# EAGLE schematic cft (EAGLE 5.11), part 1 of 7
DRAWN_BY: Alexios; PROJECT_NAME: CFT Mini-Computer; REVISION: Rev A; SHEET_DESCRIPTION: General Purpose I/O, 2/2; SIMULATION_FILENAME: N/A; URL: http://www.bedroomlan.org/cft

## Sheet 1 of 49
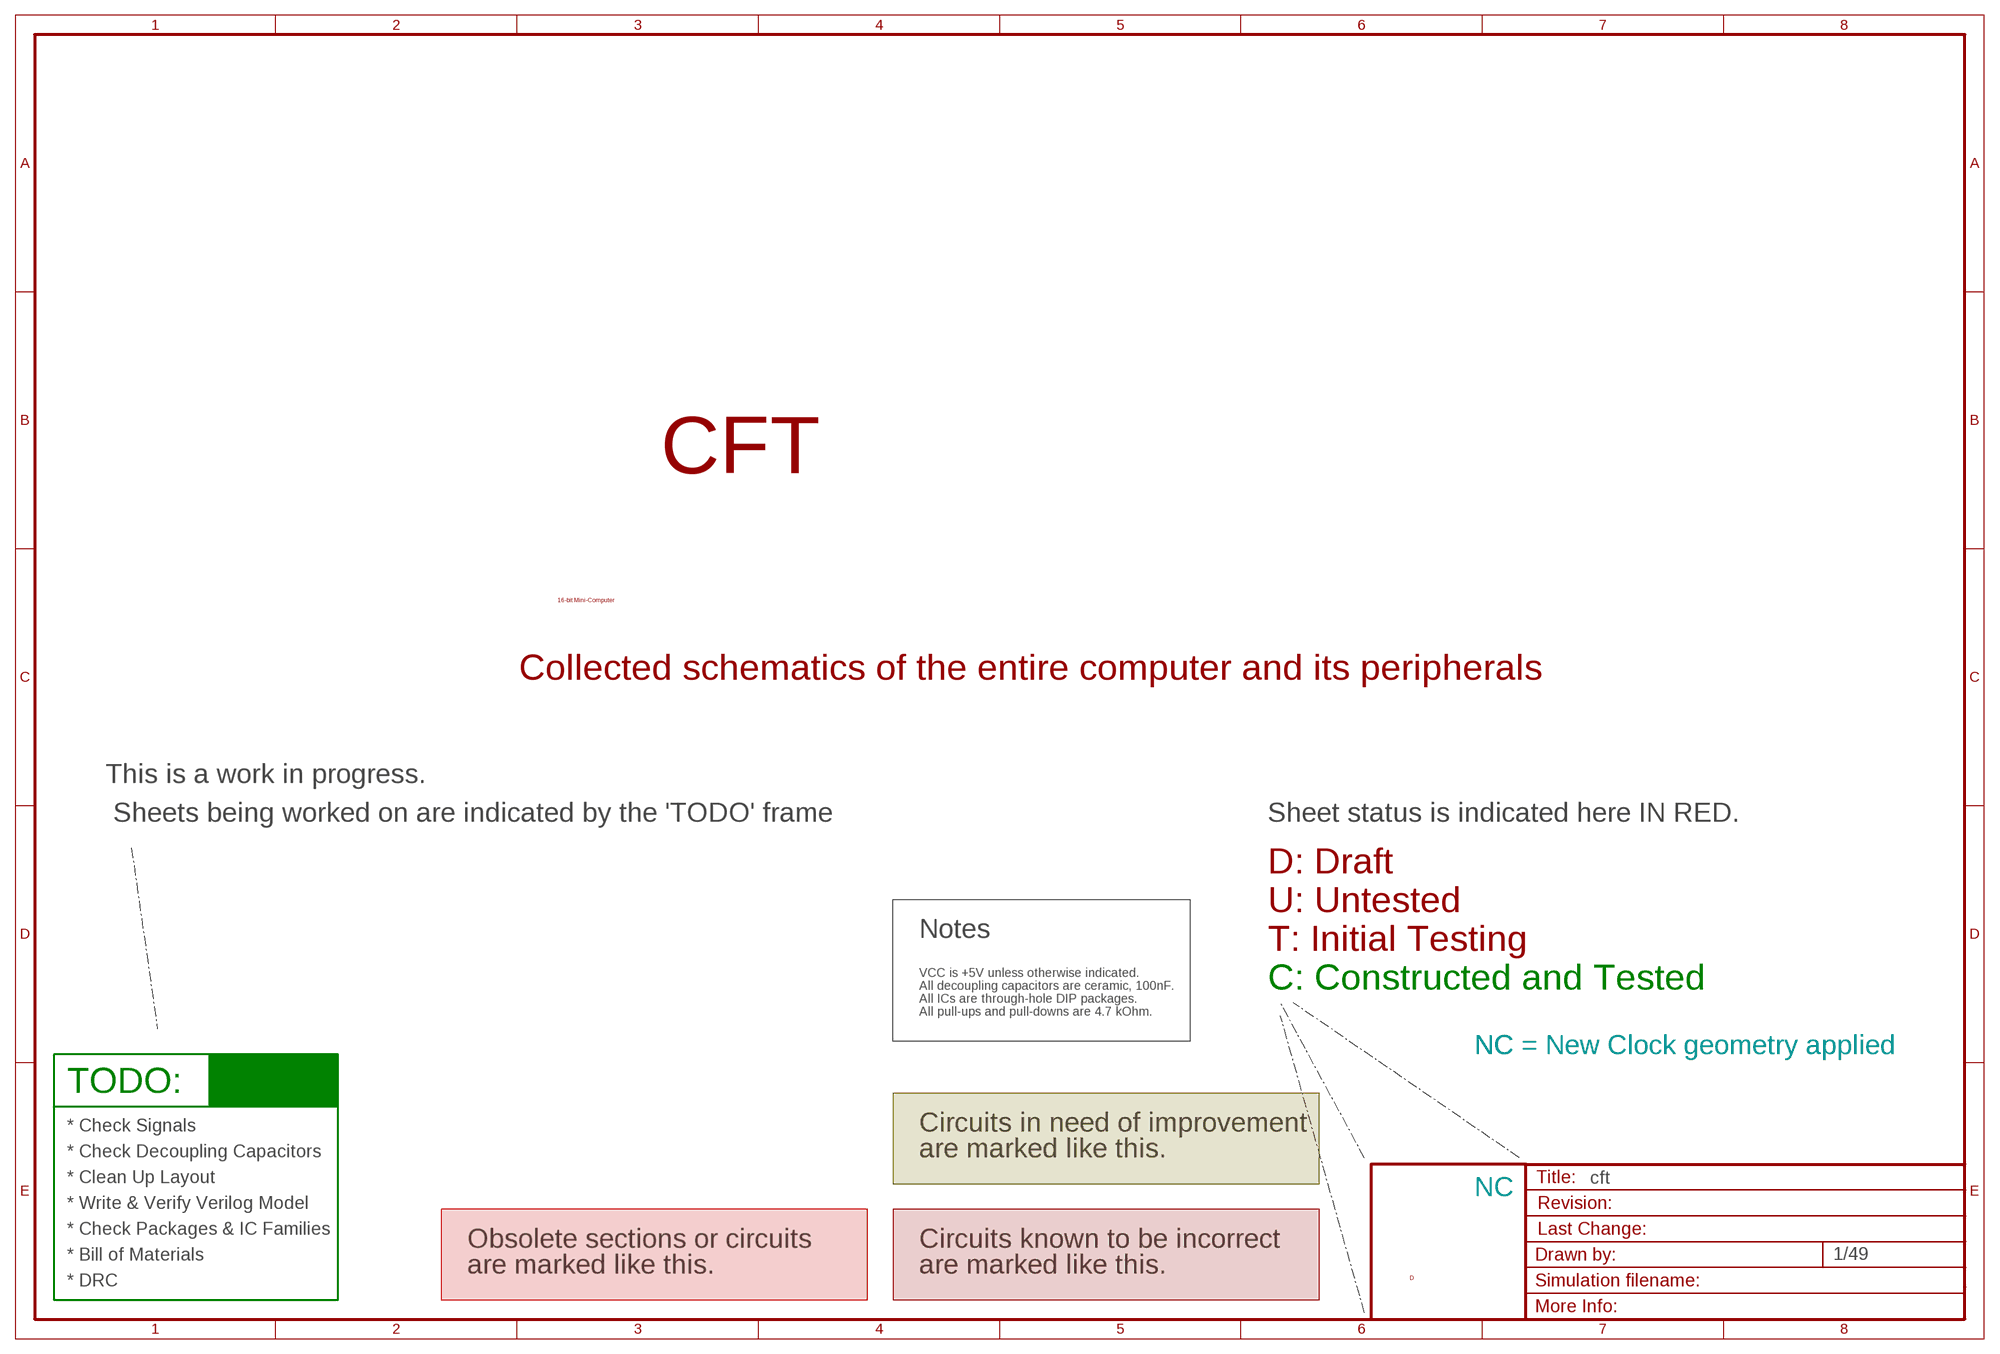
[diagram p0: schematic, sheet 1]

### Notes on the sheet
- CFT
- 16-bit Mini-Computer
- Collected schematics of the entire computer and its peripherals
- This is a work in progress.
- Sheets being worked on are indicated by the 'TODO' frame | Sheet status is indicated here IN RED.
- D: Draft
- U: Untested
- Notes
- T: Initial Testing
- VCC is +5V unless otherwise indicated.
- All decoupling capacitors are ceramic, 100nF. | C: Constructed and Tested
- All ICs are through-hole DIP packages.
- All pull-ups and pull-downs are 4.7 kOhm.
- NC | NC = New Clock geometry applied
- TODO:
- * Check Signals | Circuits in need of improvement
- * Check Decoupling Capacitors | are marked like this.
- * Clean Up Layout
- NC
- * Write & Verify Verilog Model
- * Check Packages & IC Families
- Obsolete sections or circuits | Circuits known to be incorrect
- * Bill of Materials
- are marked like this. | are marked like this.
- D
- * DRC

## Sheet 2 of 49
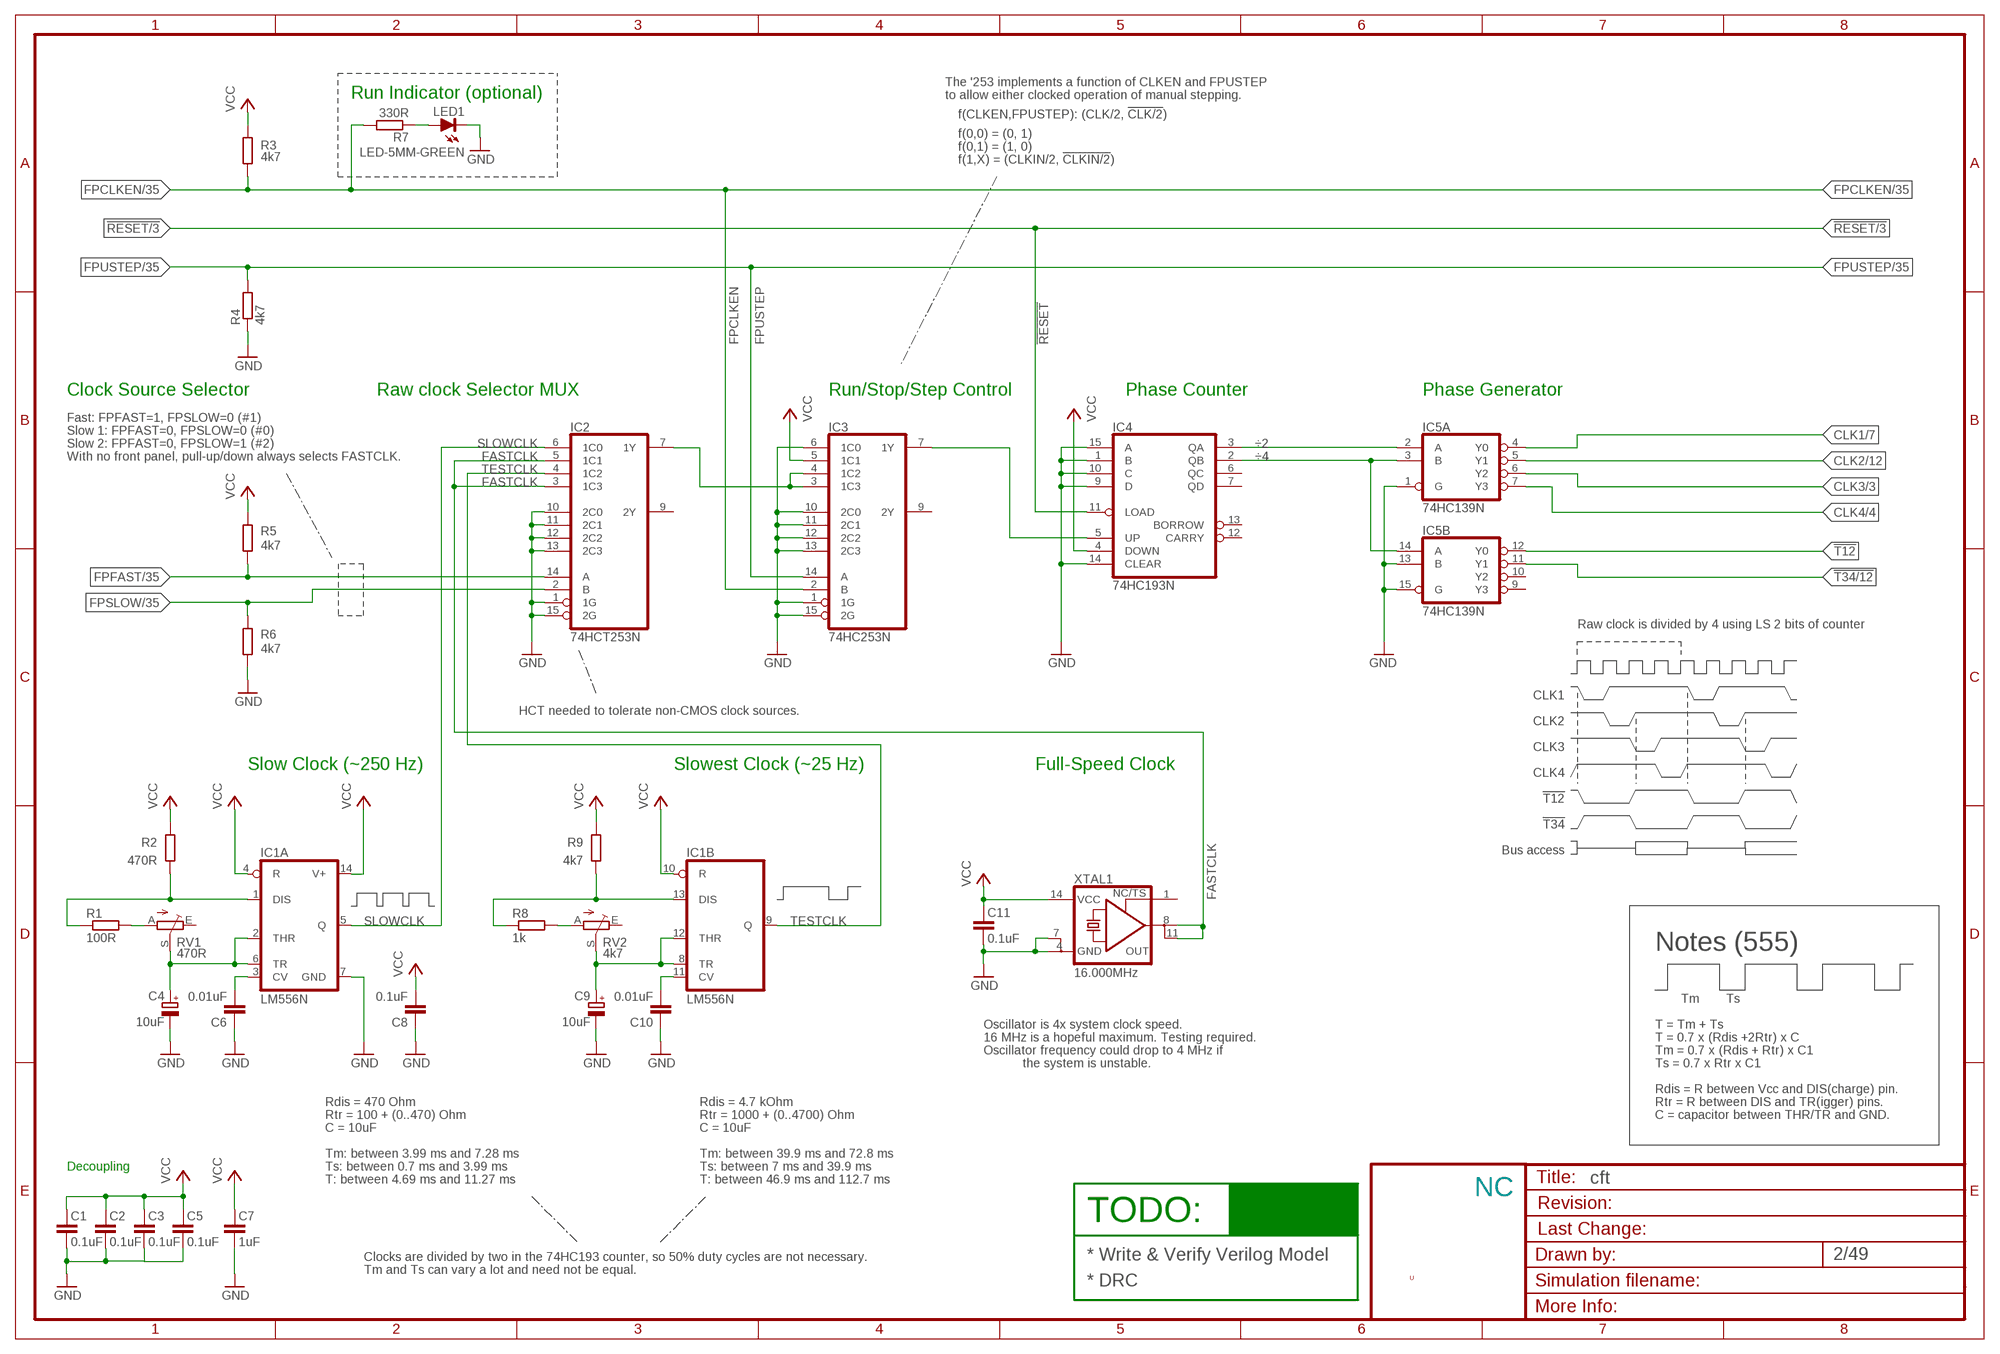
[diagram p1: schematic, sheet 2]

### Parts
C1  0.1uF  C-EU025-024X044  [C025-024X044]
C2  0.1uF  C-EU025-024X044  [C025-024X044]
C3  0.1uF  C-EU025-024X044  [C025-024X044]
C4  10uF  CPOL-EUE2.5-5  [E2,5-5]
C5  0.1uF  C-EU025-024X044  [C025-024X044]
C6  0.01uF  C-EU025-024X044  [C025-024X044]
C7  1uF  C-EU025-024X044  [C025-024X044]
C8  0.1uF  C-EU025-024X044  [C025-024X044]
C9  10uF  CPOL-EUE2.5-5  [E2,5-5]
C10  0.01uF  C-EU025-024X044  [C025-024X044]
C11  0.1uF  C-EU025-024X044  [C025-024X044]
IC1  LM556N  [DIL14]
IC2  74HCT253N  [DIL16]
IC3  74HC253N  [DIL16]
IC4  74HC193N  [DIL16]
IC5  74HC139N  [DIL16]
LED1  LED-5MM-GREEN  [LED5MM]
R1  100R  R-EU_0204/7  [0204/7]
R2  470R  R-EU_0204/7  [0204/7]
R3  4k7  R-EU_0204/7  [0204/7]
R4  4k7  R-EU_0204/7  [0204/7]
R5  4k7  R-EU_0204/7  [0204/7]
R6  4k7  R-EU_0204/7  [0204/7]
R7  330R  R-EU_0204/7  [0204/7]
R8  1k  R-EU_0204/7  [0204/7]
R9  4k7  R-EU_0204/7  [0204/7]
RV1  470R  TRIM_EU-CT6  [CT6]
RV2  4k7  TRIM_EU-CT6  [CT6]
XTAL1  16.000MHz  XO2-08-14-SOCKET  [DIL0814S]

### Nets
!RESET: IC4.11(LOAD) ; also sheet 3,4,7,8,10,11,12,13,14,17,18,19,20,21,22,25,26,28,29,30,31,44,45,46,47
!T12: IC5.12(B:Y0)
!T34: IC5.11(B:Y1) ; also sheet 12,18,44,45,46
CLK1: IC5.4(A:Y0) ; also sheet 7,27,31,43,44,45,46
CLK2: IC5.5(A:Y1) ; also sheet 12,44,45,46
CLK3: IC5.6(A:Y2) ; also sheet 3,7,17,19,44,45,46
CLK4: IC5.7(A:Y3) ; also sheet 4,8,12,44,45,46
FASTCLK: IC2.3(1C3) IC2.5(1C1) XTAL1.8(OUT) XTAL1.11(OUT1)
FPCLKEN: IC3.2(B) R3.1 R7.2 ; also sheet 6,35,43,45
FPFAST: IC2.14(A) R5.1 ; also sheet 6,35,40
FPSLOW: IC2.2(B) R6.1 ; also sheet 6,35,40
FPUSTEP: IC3.14(A) R4.2 ; also sheet 6,35,40,45
GND [low power]: C1.1 C2.1 C3.1 C4.- C5.1 C6.1 C7.1 C8.1 C9.- C10.1 C11.1 IC1.7(A:GND) IC2.1(1G) IC2.10(2C0) IC2.11(2C1) IC2.12(2C2) IC2.13(2C3) IC2.15(2G) IC3.1(1G) IC3.6(1C0) IC3.10(2C0) IC3.11(2C1) IC3.12(2C2) IC3.13(2C3) IC3.15(2G) IC4.1(B) IC4.9(D) IC4.10(C) IC4.14(CLEAR) IC4.15(A) IC5.1(A:G) IC5.13(B:B) IC5.15(B:G) LED1.K(C) R4.1 R6.2 XTAL1.4(GND) XTAL1.7(GND1) ; also sheet 3,4,5,6,7,8,9,10,11,12,13,14,15,16,17,18,19,20,21,22,24,25,26,27,28,29,30,31,32,33,34,35,36,37,38,39,40,41,42,43,44,45,46,47,48,49
N$20: C6.2 IC1.3(A:CV)
N$21: C4.+ IC1.2(A:THR) IC1.6(A:TR) RV1.S
N$22: R1.2 RV1.A
N$23: IC1.1(A:DIS) R1.1 R2.1
N$347: LED1.A R7.1
N$349: IC2.7(1Y) IC3.3(1C3) IC3.4(1C2)
N$385: C10.2 IC1.11(B:CV)
N$391: C9.+ IC1.8(B:TR) IC1.12(B:THR) RV2.S
N$392: R8.2 RV2.A
N$393: IC1.13(B:DIS) R8.1 R9.2
N$418: IC3.7(1Y) IC4.5(UP)
SLOWCLK: IC1.5(A:Q) IC2.6(1C0)
TESTCLK: IC1.9(B:Q) IC2.4(1C2)
VCC [low power]: C1.2 C2.2 C3.2 C5.2 C7.2 C8.2 C11.2 IC1.4(A:R) IC1.10(B:R) IC1.14(A:V+) IC3.5(1C1) IC4.4(DOWN) R2.2 R3.2 R5.2 R9.1 XTAL1.14(VCC) ; also sheet 3,4,6,7,8,9,10,11,12,13,14,15,16,17,18,19,20,21,22,24,25,26,27,28,29,30,31,34,35,36,37,38,39,40,41,42,43,44,45,46,47,48,49
÷2: IC4.3(QA) IC5.2(A:A)
÷4: IC4.2(QB) IC5.3(A:B) IC5.14(B:A)
Unconnected: IC2.9(2Y) IC3.9(2Y) IC4.6(QC) IC4.7(QD) IC4.12(CARRY) IC4.13(BORROW) IC5.9(B:Y3) IC5.10(B:Y2) RV1.E RV2.E XTAL1.1(TS)

### Notes on the sheet
- The '253 implements a function of CLKEN and FPUSTEP
- Run Indicator (optional) | to allow either clocked operation of manual stepping.
- f(CLKEN,FPUSTEP): (CLK/2, !CLK/2!)
- f(0,0) = (0, 1)
- f(0,1) = (1, 0)
- f(1,X) = (CLKIN/2, !CLKIN/2!)
- Clock Source Selector | Raw clock Selector MUX | Run/Stop/Step Control | Phase Counter | Phase Generator
- Fast: FPFAST=1, FPSLOW=0 (#1)
- Slow 1: FPFAST=0, FPSLOW=0 (#0)
- Slow 2: FPFAST=0, FPSLOW=1 (#2)
- With no front panel, pull-up/down always selects FASTCLK.
- Raw clock is divided by 4 using LS 2 bits of counter
- CLK1
- HCT needed to tolerate non-CMOS clock sources.
- CLK2
- CLK3
- Slow Clock (~250 Hz) | Slowest Clock (~25 Hz) | Full-Speed Clock
- CLK4
- !T12
- !T34
- Bus access
- Notes (555)
- Tm | Ts
- Oscillator is 4x system clock speed. | T = Tm + Ts
- 16 MHz is a hopeful maximum. Testing required. | T = 0.7 x (Rdis +2Rtr) x C
- Oscillator frequency could drop to 4 MHz if | Tm = 0.7 x (Rdis + Rtr) x C1
- the system is unstable. | Ts = 0.7 x Rtr x C1
- Rdis = R between Vcc and DIS(charge) pin.
- Rdis = 470 Ohm | Rdis = 4.7 kOhm | Rtr = R between DIS and TR(igger) pins.
- Rtr = 100 + (0..470) Ohm | Rtr = 1000 + (0..4700) Ohm | C = capacitor between THR/TR and GND.
- C = 10uF | C = 10uF
- Tm: between 3.99 ms and 7.28 ms | Tm: between 39.9 ms and 72.8 ms
- Decoupling | Ts: between 0.7 ms and 3.99 ms | Ts: between 7 ms and 39.9 ms
- T: between 4.69 ms and 11.27 ms | T: between 46.9 ms and 112.7 ms
- NC
- TODO:
- Clocks are divided by two in the 74HC193 counter, so 50% duty cycles are not necessary. | * Write & Verify Verilog Model
- Tm and Ts can vary a lot and need not be equal.
- U
- * DRC

## Sheet 3 of 49
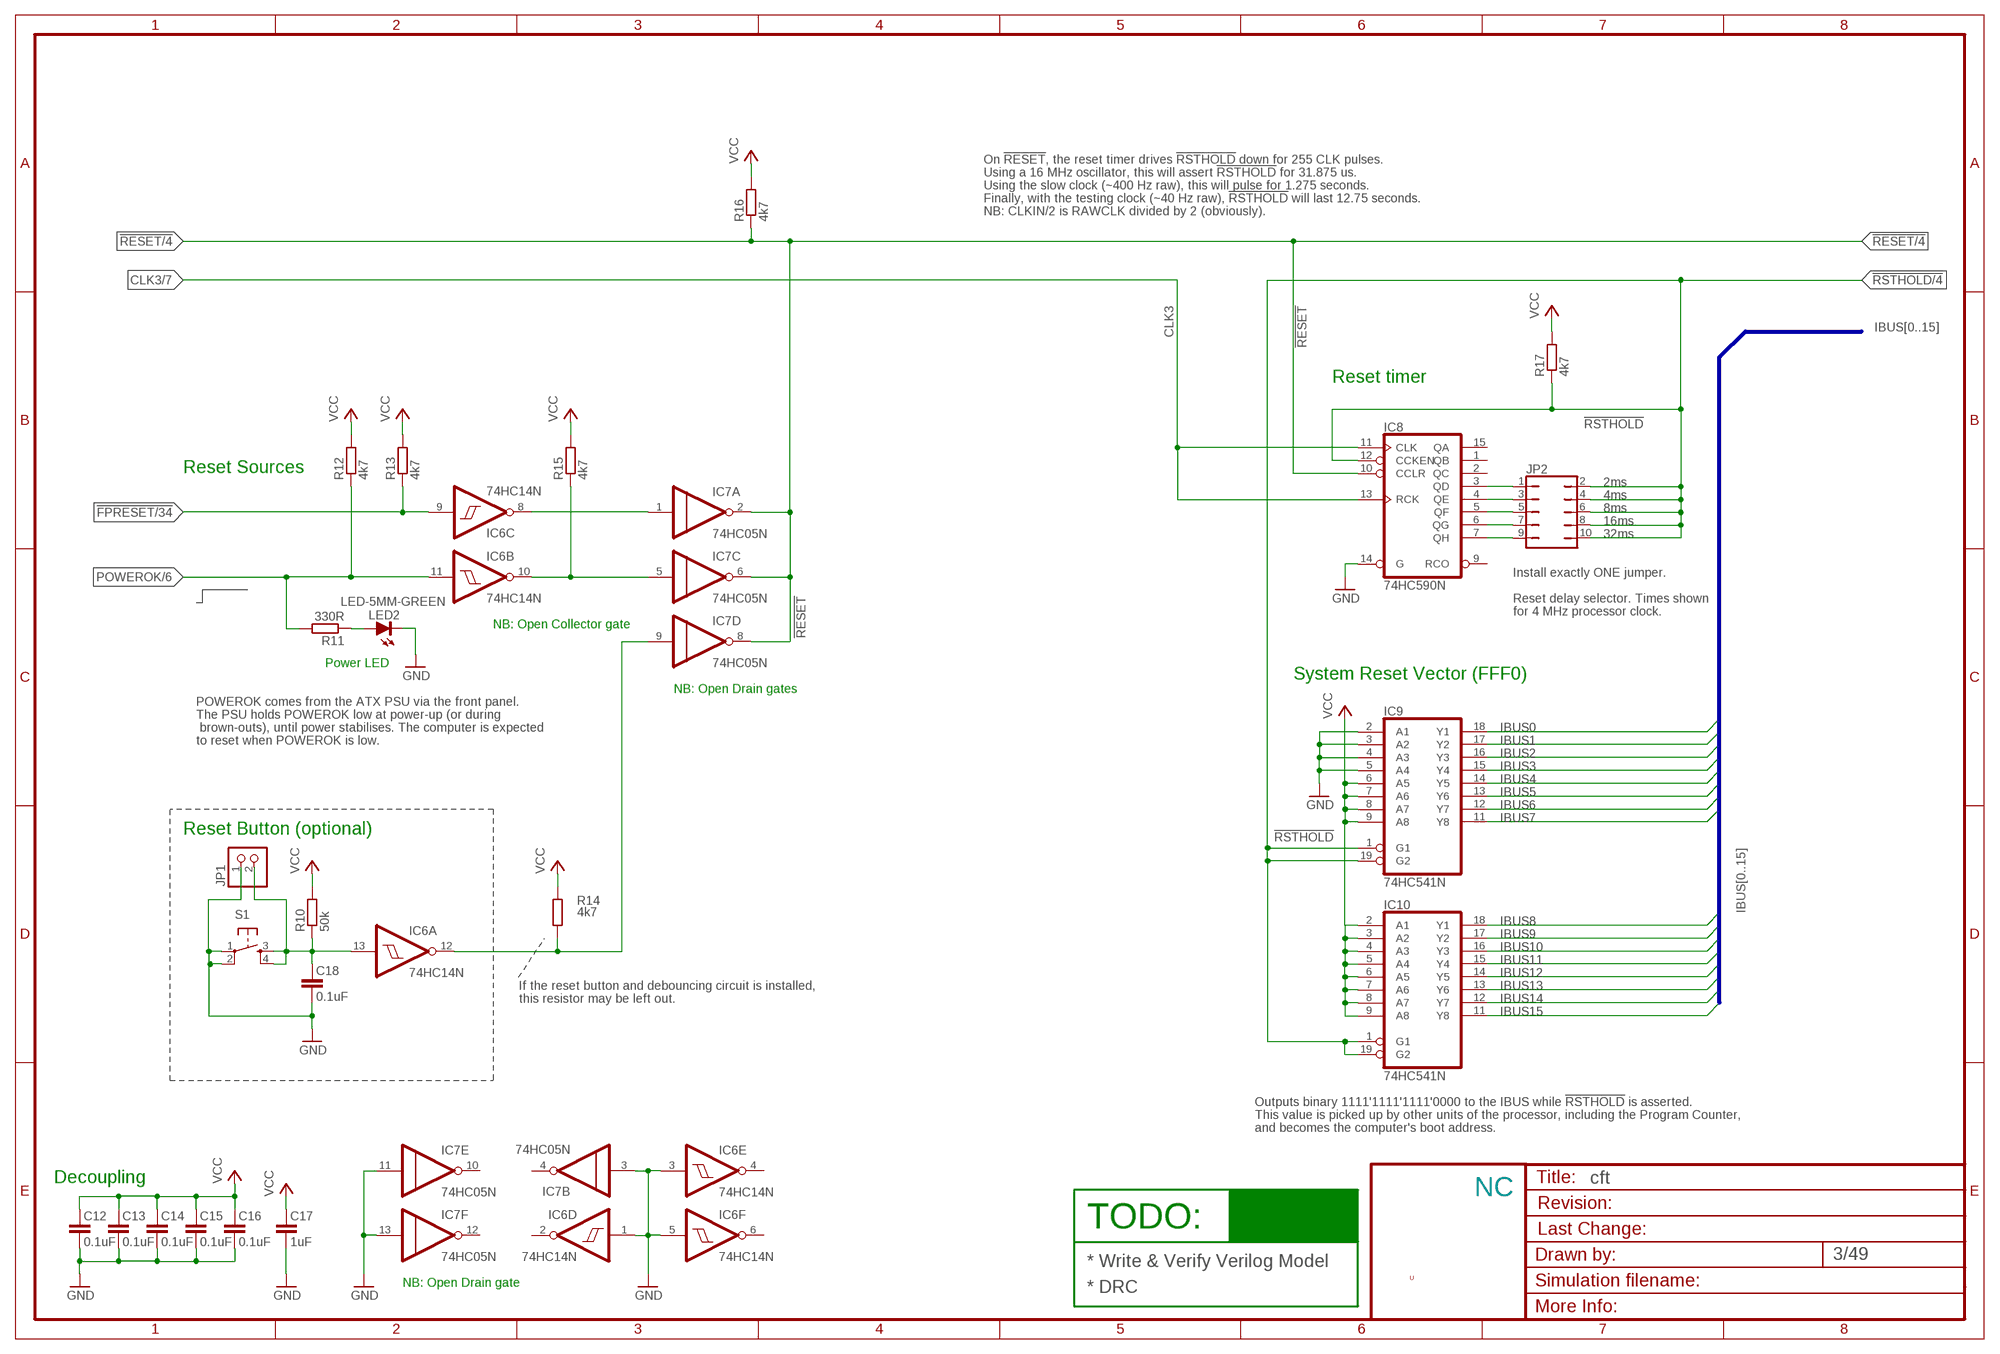
[diagram p2: schematic, sheet 3]

### Parts
C12  0.1uF  C-EU025-024X044  [C025-024X044]
C13  0.1uF  C-EU025-024X044  [C025-024X044]
C14  0.1uF  C-EU025-024X044  [C025-024X044]
C15  0.1uF  C-EU025-024X044  [C025-024X044]
C16  0.1uF  C-EU025-024X044  [C025-024X044]
C17  1uF  C-EU025-024X044  [C025-024X044]
C18  0.1uF  C-EU025-024X044  [C025-024X044]
IC6  74HC14N  [DIL14]
IC7  74HC05N  [DIL14]
IC8  74HC590N  [DIL16]
IC9  74HC541N  [DIL20]
IC10  74HC541N  [DIL20]
JP1  PINHD-1X2  [1X02]
JP2  JP5Q  [JP5Q]
LED2  LED-5MM-GREEN  [LED5MM]
R10  50k  R-EU_R0805  [R0805]
R11  330R  R-EU_0204/7  [0204/7]
R12  4k7  R-EU_0204/7  [0204/7]
R13  4k7  R-EU_0204/7  [0204/7]
R14  4k7  R-EU_0204/7  [0204/7]
R15  4k7  R-EU_0204/7  [0204/7]
R16  4k7  R-EU_0204/7  [0204/7]
R17  4k7  R-EU_0204/7  [0204/7]
S1  TAC_SWITCHPTH  [TACTILE-PTH]

### Nets
!FPRESET: IC6.9(C:I) R13.1 ; also sheet 6,34,40
!RESET: IC7.2(A:O) IC7.6(C:O) IC7.8(D:O) IC8.10(CCLR) R16.1 ; also sheet 2,4,7,8,10,11,12,13,14,17,18,19,20,21,22,25,26,28,29,30,31,44,45,46,47
!RSTHOLD: IC8.12(CCKEN) IC9.1(G1) IC9.19(G2) IC10.1(G1) IC10.19(G2) JP2.2 JP2.4 JP2.6 JP2.8 JP2.10 R17.1 ; also sheet 4,6,18
CLK3: IC8.11(CLK) IC8.13(RCK) ; also sheet 2,7,17,19,44,45,46
GND [low power]: C12.1 C13.1 C14.1 C15.1 C16.1 C17.1 C18.1 IC6.1(D:I) IC6.3(E:I) IC6.5(F:I) IC7.3(B:I) IC7.11(E:I) IC7.13(F:I) IC8.14(G) IC9.2(A1) IC9.3(A2) IC9.4(A3) IC9.5(A4) JP1.1 LED2.K(C) S1.1 S1.2 ; also sheet 2,4,5,6,7,8,9,10,11,12,13,14,15,16,17,18,19,20,21,22,24,25,26,27,28,29,30,31,32,33,34,35,36,37,38,39,40,41,42,43,44,45,46,47,48,49
IBUS0: IC9.18(Y1) ; also sheet 6,9,10,12,13,14,15,16,18,20
IBUS1: IC9.17(Y2) ; also sheet 6,9,10,12,13,14,15,16,18,20
IBUS2: IC9.16(Y3) ; also sheet 6,9,10,12,13,14,15,16,18,20
IBUS3: IC9.15(Y4) ; also sheet 6,9,10,12,13,14,15,16,18,20
IBUS4: IC9.14(Y5) ; also sheet 6,9,10,12,13,14,15,16,18,20
IBUS5: IC9.13(Y6) ; also sheet 6,9,10,12,13,14,15,16,18,20
IBUS6: IC9.12(Y7) ; also sheet 6,9,10,12,13,14,15,16,18,20
IBUS7: IC9.11(Y8) ; also sheet 6,9,10,12,13,14,15,16,18,20
IBUS8: IC10.18(Y1) ; also sheet 6,9,10,12,13,14,15,16,18,20
IBUS9: IC10.17(Y2) ; also sheet 6,9,10,12,13,14,15,16,18,20
IBUS10: IC10.16(Y3) ; also sheet 6,9,10,12,13,14,15,16,18,20
IBUS11: IC10.15(Y4) ; also sheet 6,9,10,12,13,14,15,16,18,20
IBUS12: IC10.14(Y5) ; also sheet 6,9,10,12,13,14,15,16,18,20
IBUS13: IC10.13(Y6) ; also sheet 6,9,10,12,13,14,15,16,18,20
IBUS14: IC10.12(Y7) ; also sheet 6,9,10,12,13,14,15,16,18,20
IBUS15: IC10.11(Y8) ; also sheet 6,9,10,12,13,14,15,16,18,20
N$31: IC6.10(B:O) IC7.5(C:I) R15.1
N$32: IC6.12(A:O) IC7.9(D:I) R14.1
N$33: C18.2 IC6.13(A:I) JP1.2 R10.1 S1.3 S1.4
N$36: IC8.7(QH) JP2.9
N$154: IC8.6(QG) JP2.7
N$375: IC8.5(QF) JP2.5
N$376: IC8.4(QE) JP2.3
N$377: IC8.3(QD) JP2.1
N$378: IC6.8(C:O) IC7.1(A:I)
POWERLED: LED2.A R11.1
POWEROK: IC6.11(B:I) R11.2 R12.1 ; also sheet 6,40,43
VCC [low power]: C12.2 C13.2 C14.2 C15.2 C16.2 C17.2 IC9.6(A5) IC9.7(A6) IC9.8(A7) IC9.9(A8) IC10.2(A1) IC10.3(A2) IC10.4(A3) IC10.5(A4) IC10.6(A5) IC10.7(A6) IC10.8(A7) IC10.9(A8) R10.2 R12.2 R13.2 R14.2 R15.2 R16.2 R17.2 ; also sheet 2,4,6,7,8,9,10,11,12,13,14,15,16,17,18,19,20,21,22,24,25,26,27,28,29,30,31,34,35,36,37,38,39,40,41,42,43,44,45,46,47,48,49
Unconnected: IC6.2(D:O) IC6.4(E:O) IC6.6(F:O) IC7.4(B:O) IC7.10(E:O) IC7.12(F:O) IC8.1(QB) IC8.2(QC) IC8.9(RCO) IC8.15(QA)

### Buses
IBUS[0..15]

### Notes on the sheet
- On !RESET!, the reset timer drives !RSTHOLD! down for 255 CLK pulses.
- Using a 16 MHz oscillator, this will assert !RSTHOLD! for 31.875 us.
- Using the slow clock (~400 Hz raw), this will pulse for 1.275 seconds.
- Finally, with the testing clock (~40 Hz raw), !RSTHOLD! will last 12.75 seconds.
- NB: CLKIN/2 is RAWCLK divided by 2 (obviously).
- Reset timer
- Reset Sources
- 2ms
- 4ms
- 8ms
- 16ms
- 32ms
- Install exactly ONE jumper.
- Reset delay selector. Times shown
- for 4 MHz processor clock.
- NB: Open Collector gate
- Power LED
- System Reset Vector (FFF0)
- NB: Open Drain gates
- POWEROK comes from the ATX PSU via the front panel.
- The PSU holds POWEROK low at power-up (or during
- brown-outs), until power stabilises. The computer is expected
- to reset when POWEROK is low.
- Reset Button (optional)
- If the reset button and debouncing circuit is installed,
- this resistor may be left out.
- Outputs binary 1111'1111'1111'0000 to the IBUS while !RSTHOLD! is asserted.
- This value is picked up by other units of the processor, including the Program Counter,
- and becomes the computer's boot address.
- Decoupling
- NC
- TODO:
- * Write & Verify Verilog Model
- U
- NB: Open Drain gate
- * DRC

## Sheet 4 of 49
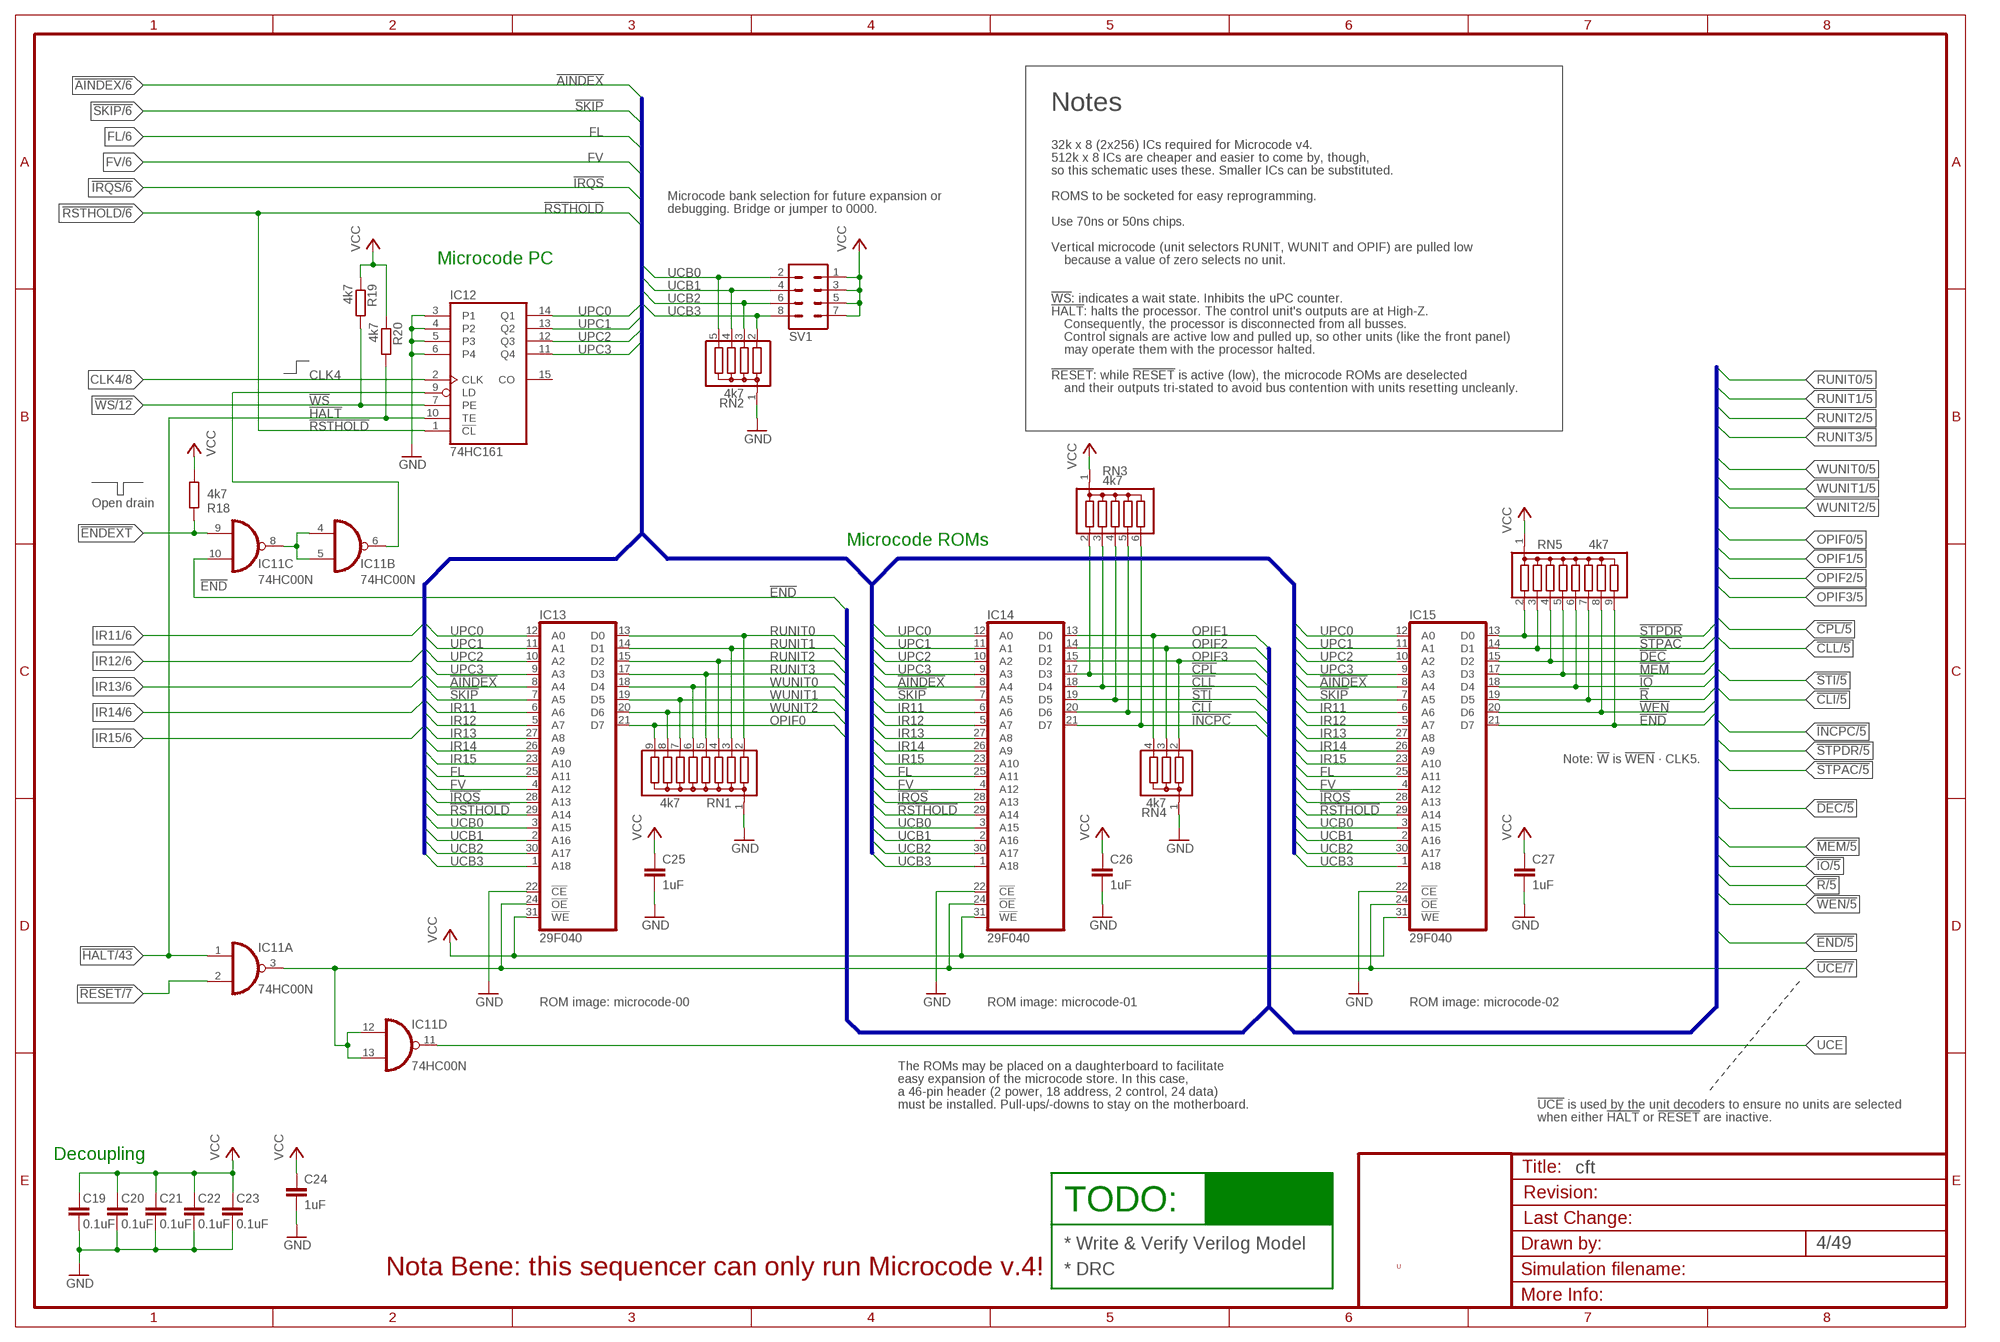
[diagram p3: schematic, sheet 4]

### Parts
C19  0.1uF  C-EU025-024X044  [C025-024X044]
C20  0.1uF  C-EU025-024X044  [C025-024X044]
C21  0.1uF  C-EU025-024X044  [C025-024X044]
C22  0.1uF  C-EU025-024X044  [C025-024X044]
C23  0.1uF  C-EU025-024X044  [C025-024X044]
C24  1uF  C-EU025-024X044  [C025-024X044]
C25  1uF  C-EU025-024X044  [C025-024X044]
C26  1uF  C-EU025-024X044  [C025-024X044]
C27  1uF  C-EU025-024X044  [C025-024X044]
IC11  74HC00N  [DIL14]
IC12  74HC161  4161P  [DIL16]
IC13  29F040  29F040PLCC32  [PLCC32]
IC14  29F040  29F040PLCC32  [PLCC32]
IC15  29F040  29F040PLCC32  [PLCC32]
R18  4k7  R-EU_0204/7  [0204/7]
R19  4k7  R-EU_0204/7  [0204/7]
R20  4k7  R-EU_0204/7  [0204/7]
RN1  4k7  G08R  [SIL9]
RN2  4k7  G04R  [SIL5]
RN3  4k7  G05R  [SIL6]
RN4  4k7  G03R  [SIL4]
RN5  4k7  G08R  [SIL9]
SV1  MA04-2  [MA04-2]

### Nets
!AINDEX: IC13.8(A4) IC14.8(A4) IC15.8(A4) ; also sheet 6,13
!CLI: IC14.20(D6) RN3.5 ; also sheet 5,6,11
!CLL: IC14.18(D4) RN3.3 ; also sheet 5,6,17
!CPL: IC14.17(D3) RN3.2 ; also sheet 5,6,17
!DEC: IC15.15(D2) RN5.4 ; also sheet 5,6,15,16
!END: IC11.10(C:I1) IC15.21(D7) RN5.9 ; also sheet 5,6,9,11,13
!ENDEXT: IC11.9(C:I0) R18.2 ; also sheet 44,45,46
!HALT: IC11.1(A:I0) IC12.10(TE) R20.2 ; also sheet 43,44,45,46
!INCPC: IC14.21(D7) RN3.6 ; also sheet 5,6,14,42
!IO: IC15.18(D4) RN5.6 ; also sheet 5,6,12,13,42,44,45,46
!IRQS: IC13.28(A13) IC14.28(A13) IC15.28(A13) ; also sheet 6,11,20,40,44,45,46
!MEM: IC15.17(D3) RN5.5 ; also sheet 5,6,12,13,21,24,42,44,45,46
!R: IC15.19(D5) RN5.7 ; also sheet 5,6,12,22,24,25,26,27,28,29,30,41,42,44,45,46,47,48
!RESET: IC11.2(A:I1) ; also sheet 2,3,7,8,10,11,12,13,14,17,18,19,20,21,22,25,26,28,29,30,31,44,45,46,47
!RSTHOLD: IC12.1(!CL) IC13.29(A14) IC14.29(A14) IC15.29(A14) ; also sheet 3,6,18
!SKIP: IC13.7(A5) IC14.7(A5) IC15.7(A5) ; also sheet 6,8
!STI: IC14.19(D5) RN3.4 ; also sheet 5,6,11
!STPAC: IC15.14(D1) RN5.3 ; also sheet 5,6,16
!STPDR: IC15.13(D0) RN5.2 ; also sheet 5,6,15
!UCE: IC11.3(A:O) IC11.12(D:I0) IC11.13(D:I1) IC13.24(!OE) IC14.24(!OE) IC15.24(!OE) ; also sheet 7
!WEN: IC15.20(D6) RN5.8 ; also sheet 5,6,12,42
!WS: IC12.7(PE) R19.2 ; also sheet 12,44,45,46
CLK4: IC12.2(CLK) ; also sheet 2,8,12,44,45,46
FL: IC13.25(A11) IC14.25(A11) IC15.25(A11) ; also sheet 6,8,17,19,20
FV: IC13.4(A12) IC14.4(A12) IC15.4(A12) ; also sheet 6,8,19
GND [low power]: C19.1 C20.1 C21.1 C22.1 C23.1 C24.2 C25.2 C26.2 C27.2 IC12.3(P1) IC12.4(P2) IC12.5(P3) IC12.6(P4) IC13.22(!CE) IC14.22(!CE) IC15.22(!CE) RN1.1 RN2.1 RN4.1 ; also sheet 2,3,5,6,7,8,9,10,11,12,13,14,15,16,17,18,19,20,21,22,24,25,26,27,28,29,30,31,32,33,34,35,36,37,38,39,40,41,42,43,44,45,46,47,48,49
IR11: IC13.6(A6) IC14.6(A6) IC15.6(A6) ; also sheet 6,10,32,38
IR12: IC13.5(A7) IC14.5(A7) IC15.5(A7) ; also sheet 6,10,32,38
IR13: IC13.27(A8) IC14.27(A8) IC15.27(A8) ; also sheet 6,10,32,38
IR14: IC13.26(A9) IC14.26(A9) IC15.26(A9) ; also sheet 6,10,32,38
IR15: IC13.23(A10) IC14.23(A10) IC15.23(A10) ; also sheet 6,10,32,38
N$147: IC11.6(B:O) IC12.9(LD)
N$842: IC11.4(B:I0) IC11.5(B:I1) IC11.8(C:O)
OPIF0: IC13.21(D7) RN1.9 ; also sheet 5,6,8
OPIF1: IC14.13(D0) RN4.4 ; also sheet 5,6,8
OPIF2: IC14.14(D1) RN4.3 ; also sheet 5,6,8
OPIF3: IC14.15(D2) RN4.2 ; also sheet 5,6,8
RUNIT0: IC13.13(D0) RN1.2 ; also sheet 5,6,7,18,19
RUNIT1: IC13.14(D1) RN1.3 ; also sheet 5,6,7,18,19
RUNIT2: IC13.15(D2) RN1.4 ; also sheet 5,6,7,18
RUNIT3: IC13.17(D3) RN1.5 ; also sheet 5,6,7,18
UCB0: IC13.3(A15) IC14.3(A15) IC15.3(A15) RN2.5 SV1.2 ; also sheet 32
UCB1: IC13.2(A16) IC14.2(A16) IC15.2(A16) RN2.4 SV1.4 ; also sheet 32
UCB2: IC13.30(A17) IC14.30(A17) IC15.30(A17) RN2.3 SV1.6 ; also sheet 32
UCB3: IC13.1(A18) IC14.1(A18) IC15.1(A18) RN2.2 SV1.8 ; also sheet 32
UCE: IC11.11(D:O)
UPC0: IC12.14(Q1) IC13.12(A0) IC14.12(A0) IC15.12(A0) ; also sheet 6
UPC1: IC12.13(Q2) IC13.11(A1) IC14.11(A1) IC15.11(A1) ; also sheet 6
UPC2: IC12.12(Q3) IC13.10(A2) IC14.10(A2) IC15.10(A2) ; also sheet 6
UPC3: IC12.11(Q4) IC13.9(A3) IC14.9(A3) IC15.9(A3) ; also sheet 6
VCC [low power]: C19.2 C20.2 C21.2 C22.2 C23.2 C24.1 C25.1 C26.1 C27.1 IC13.31(!WE) IC14.31(!WE) IC15.31(!WE) R18.1 R19.1 R20.1 RN3.1 RN5.1 SV1.1 SV1.3 SV1.5 SV1.7 ; also sheet 2,3,6,7,8,9,10,11,12,13,14,15,16,17,18,19,20,21,22,24,25,26,27,28,29,30,31,34,35,36,37,38,39,40,41,42,43,44,45,46,47,48,49
WUNIT0: IC13.18(D4) RN1.6 ; also sheet 5,6,7
WUNIT1: IC13.19(D5) RN1.7 ; also sheet 5,6,7
WUNIT2: IC13.20(D6) RN1.8 ; also sheet 5,6,7
Unconnected: IC12.15(CO)

### Buses
MCINSTR:RUNIT[0..3],WUNIT[0..2],OPIF[0..3],!CPL,!CLL,!STI,!CLI,!INCPC,!STPDR,!STPAC,!DEC,!MEM,!IO,!R,!W,!END
MCADDR:UPC[0..3],!AINDEX,!SKIP,IR[11..15],FL,FV,!IRQS,!RSTHOLD
MCADDR:UPC[0..3],!AINDEX,!SKIP,IR[11..15],FL,FV,!IRQS,!RSTHOLD,UCB[0..3]

### Notes on the sheet
- Notes
- 32k x 8 (2x256) ICs required for Microcode v4.
- 512k x 8 ICs are cheaper and easier to come by, though,
- so this schematic uses these. Smaller ICs can be substituted.
- Microcode bank selection for future expansion or | ROMS to be socketed for easy reprogramming.
- debugging. Bridge or jumper to 0000.
- Use 70ns or 50ns chips.
- Vertical microcode (unit selectors RUNIT, WUNIT and OPIF) are pulled low
- Microcode PC | because a value of zero selects no unit.
- !WS!: indicates a wait state. Inhibits the uPC counter.
- !HALT!: halts the processor. The control unit's outputs are at High-Z.
- Consequently, the processor is disconnected from all busses.
- Control signals are active low and pulled up, so other units (like the front panel)
- may operate them with the processor halted.
- !RESET!: while !RESET! is active (low), the microcode ROMs are deselected
- and their outputs tri-stated to avoid bus contention with units resetting uncleanly.
- Open drain
- Microcode ROMs
- Note: !W! is !WEN! · CLK5.
- ROM image: microcode-00 | ROM image: microcode-01 | ROM image: microcode-02
- The ROMs may be placed on a daughterboard to facilitate
- easy expansion of the microcode store. In this case,
- a 46-pin header (2 power, 18 address, 2 control, 24 data)
- must be installed. Pull-ups/-downs to stay on the motherboard. | !UCE! is used by the unit decoders to ensure no units are selected
- when either !HALT! or !RESET! are inactive.
- Decoupling
- TODO:
- * Write & Verify Verilog Model
- U
- Nota Bene: this sequencer can only run Microcode v.4! | * DRC

## Sheet 5 of 49
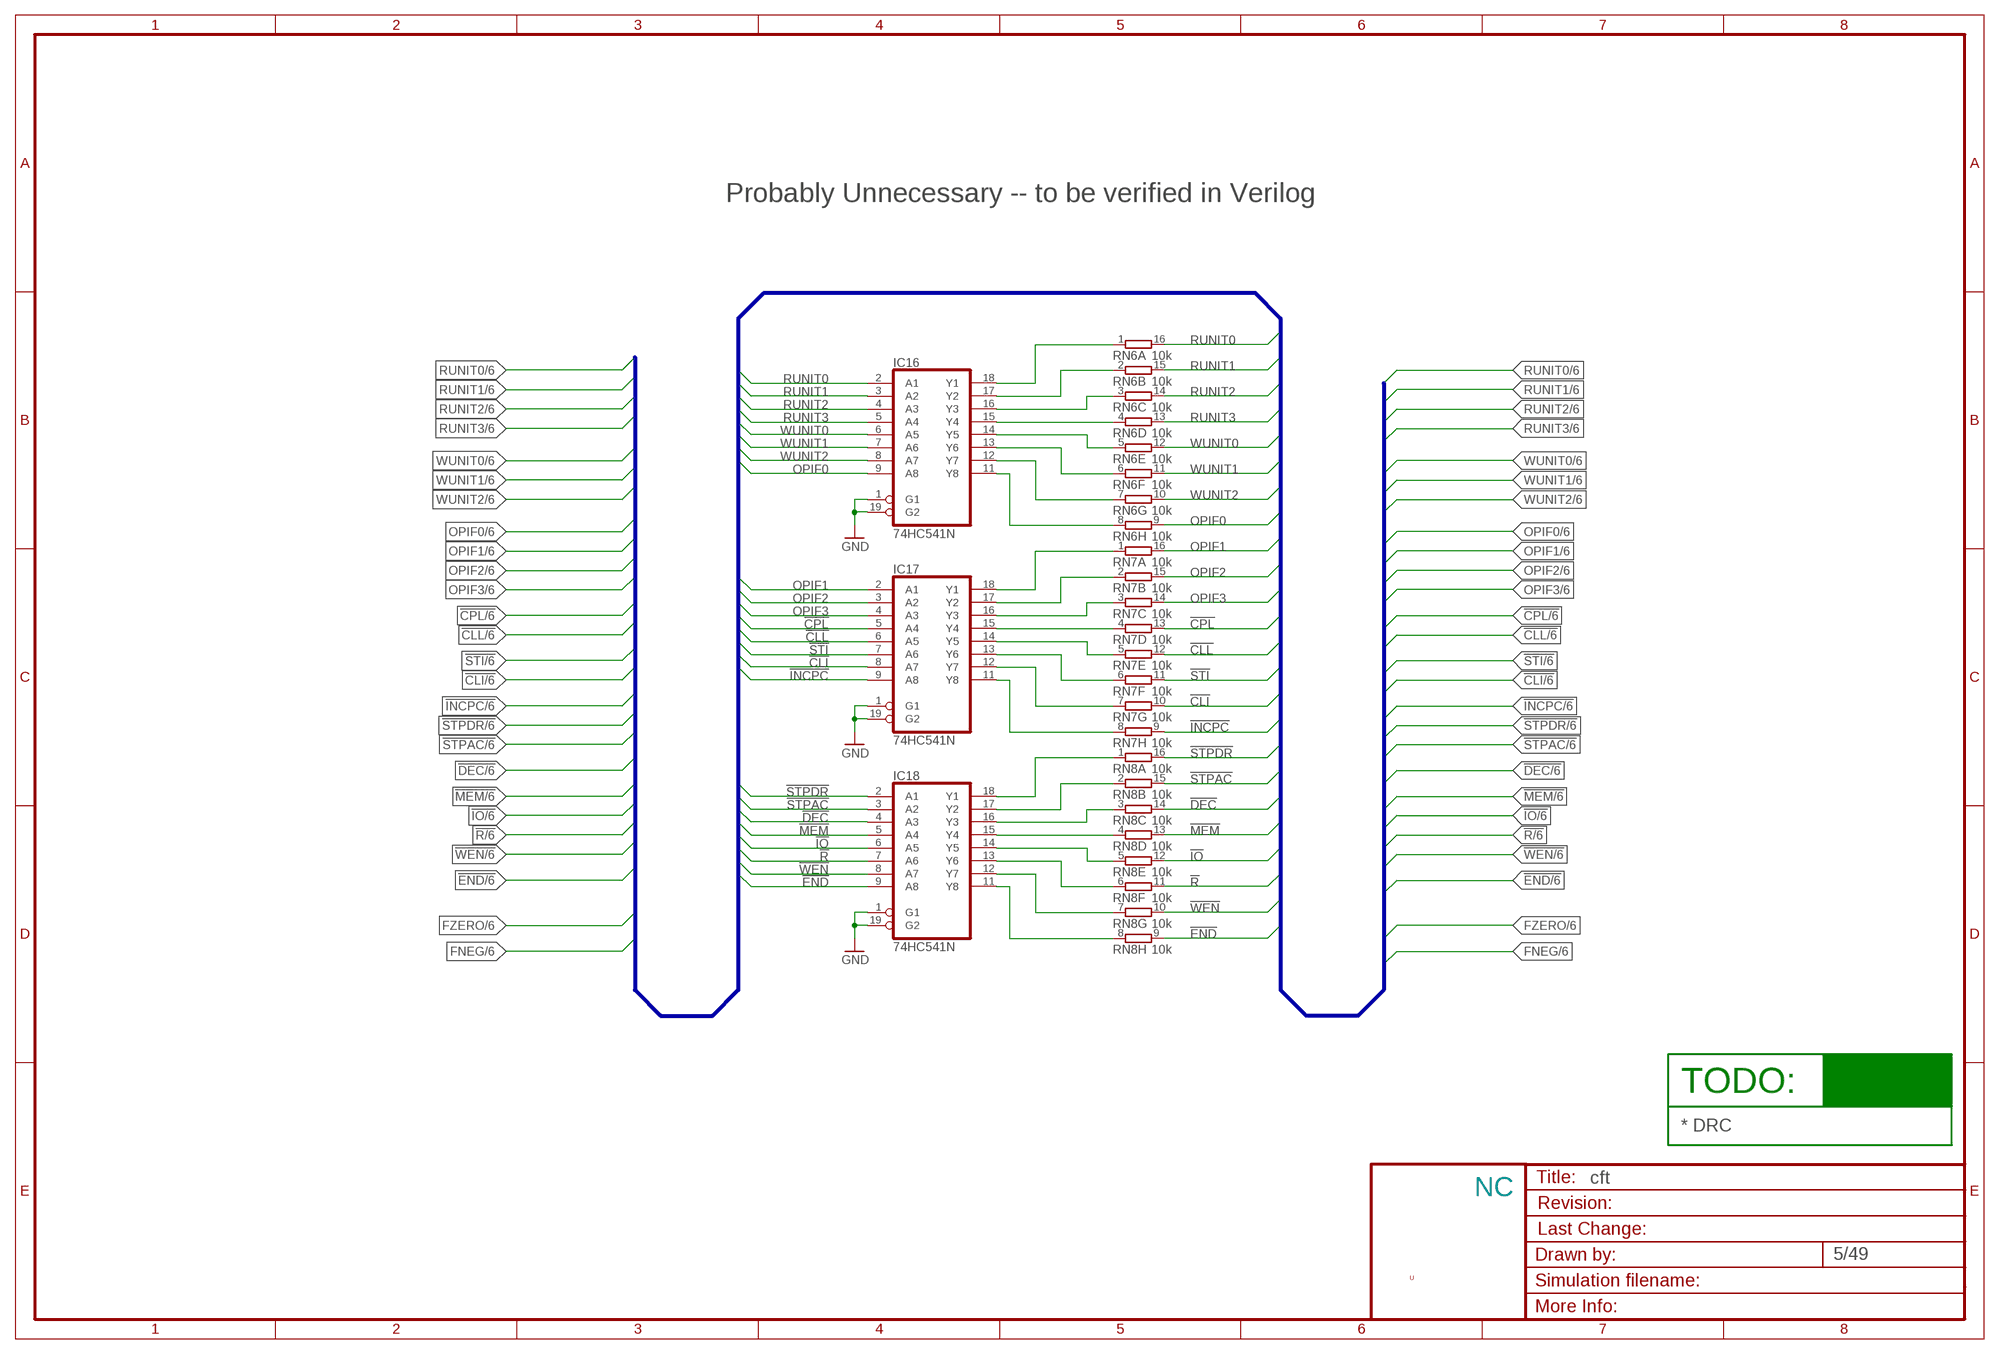
[diagram p4: schematic, sheet 5]

### Parts
IC16  74HC541N  [DIL20]
IC17  74HC541N  [DIL20]
IC18  74HC541N  [DIL20]
RN6  10k  8R-N  [DIL16]
RN7  10k  8R-N  [DIL16]
RN8  10k  8R-N  [DIL16]

### Nets
!CLI: IC17.8(A7) RN7.10 ; also sheet 4,6,11
!CLL: IC17.6(A5) RN7.12 ; also sheet 4,6,17
!CPL: IC17.5(A4) RN7.13 ; also sheet 4,6,17
!DEC: IC18.4(A3) RN8.14 ; also sheet 4,6,15,16
!END: IC18.9(A8) RN8.9 ; also sheet 4,6,9,11,13
!INCPC: IC17.9(A8) RN7.9 ; also sheet 4,6,14,42
!IO: IC18.6(A5) RN8.12 ; also sheet 4,6,12,13,42,44,45,46
!MEM: IC18.5(A4) RN8.13 ; also sheet 4,6,12,13,21,24,42,44,45,46
!R: IC18.7(A6) RN8.11 ; also sheet 4,6,12,22,24,25,26,27,28,29,30,41,42,44,45,46,47,48
!STI: IC17.7(A6) RN7.11 ; also sheet 4,6,11
!STPAC: IC18.3(A2) RN8.15 ; also sheet 4,6,16
!STPDR: IC18.2(A1) RN8.16 ; also sheet 4,6,15
!WEN: IC18.8(A7) RN8.10 ; also sheet 4,6,12,42
GND [low power]: IC16.1(G1) IC16.19(G2) IC17.1(G1) IC17.19(G2) IC18.1(G1) IC18.19(G2) ; also sheet 2,3,4,6,7,8,9,10,11,12,13,14,15,16,17,18,19,20,21,22,24,25,26,27,28,29,30,31,32,33,34,35,36,37,38,39,40,41,42,43,44,45,46,47,48,49
N$152: IC18.15(Y4) RN8.4
N$156: IC18.16(Y3) RN8.3
N$337: IC18.17(Y2) RN8.2
N$342: IC18.18(Y1) RN8.1
N$343: IC18.14(Y5) RN8.5
N$344: IC18.13(Y6) RN8.6
N$345: IC18.12(Y7) RN8.7
N$346: IC18.11(Y8) RN8.8
N$426: IC16.15(Y4) RN6.4
N$427: IC16.16(Y3) RN6.3
N$428: IC16.17(Y2) RN6.2
N$429: IC16.18(Y1) RN6.1
N$430: IC16.14(Y5) RN6.5
N$431: IC16.13(Y6) RN6.6
N$432: IC16.12(Y7) RN6.7
N$433: IC16.11(Y8) RN6.8
N$434: IC17.15(Y4) RN7.4
N$435: IC17.16(Y3) RN7.3
N$436: IC17.17(Y2) RN7.2
N$437: IC17.18(Y1) RN7.1
N$438: IC17.14(Y5) RN7.5
N$439: IC17.13(Y6) RN7.6
N$440: IC17.12(Y7) RN7.7
N$441: IC17.11(Y8) RN7.8
OPIF0: IC16.9(A8) RN6.9 ; also sheet 4,6,8
OPIF1: IC17.2(A1) RN7.16 ; also sheet 4,6,8
OPIF2: IC17.3(A2) RN7.15 ; also sheet 4,6,8
OPIF3: IC17.4(A3) RN7.14 ; also sheet 4,6,8
RUNIT0: IC16.2(A1) RN6.16 ; also sheet 4,6,7,18,19
RUNIT1: IC16.3(A2) RN6.15 ; also sheet 4,6,7,18,19
RUNIT2: IC16.4(A3) RN6.14 ; also sheet 4,6,7,18
RUNIT3: IC16.5(A4) RN6.13 ; also sheet 4,6,7,18
WUNIT0: IC16.6(A5) RN6.12 ; also sheet 4,6,7
WUNIT1: IC16.7(A6) RN6.11 ; also sheet 4,6,7
WUNIT2: IC16.8(A7) RN6.10 ; also sheet 4,6,7

### Buses
MCINSTR:RUNIT[0..3],WUNIT[0..2],OPIF[0..3],!CPL,!CLL,!STI,!CLI,!INCPC,!STPDR,!STPAC,!DEC,!MEM,!IO,!R,!W,!END

### Notes on the sheet
- Probably Unnecessary -- to be verified in Verilog
- TODO:
- * DRC
- NC
- U

## Sheet 6 of 49
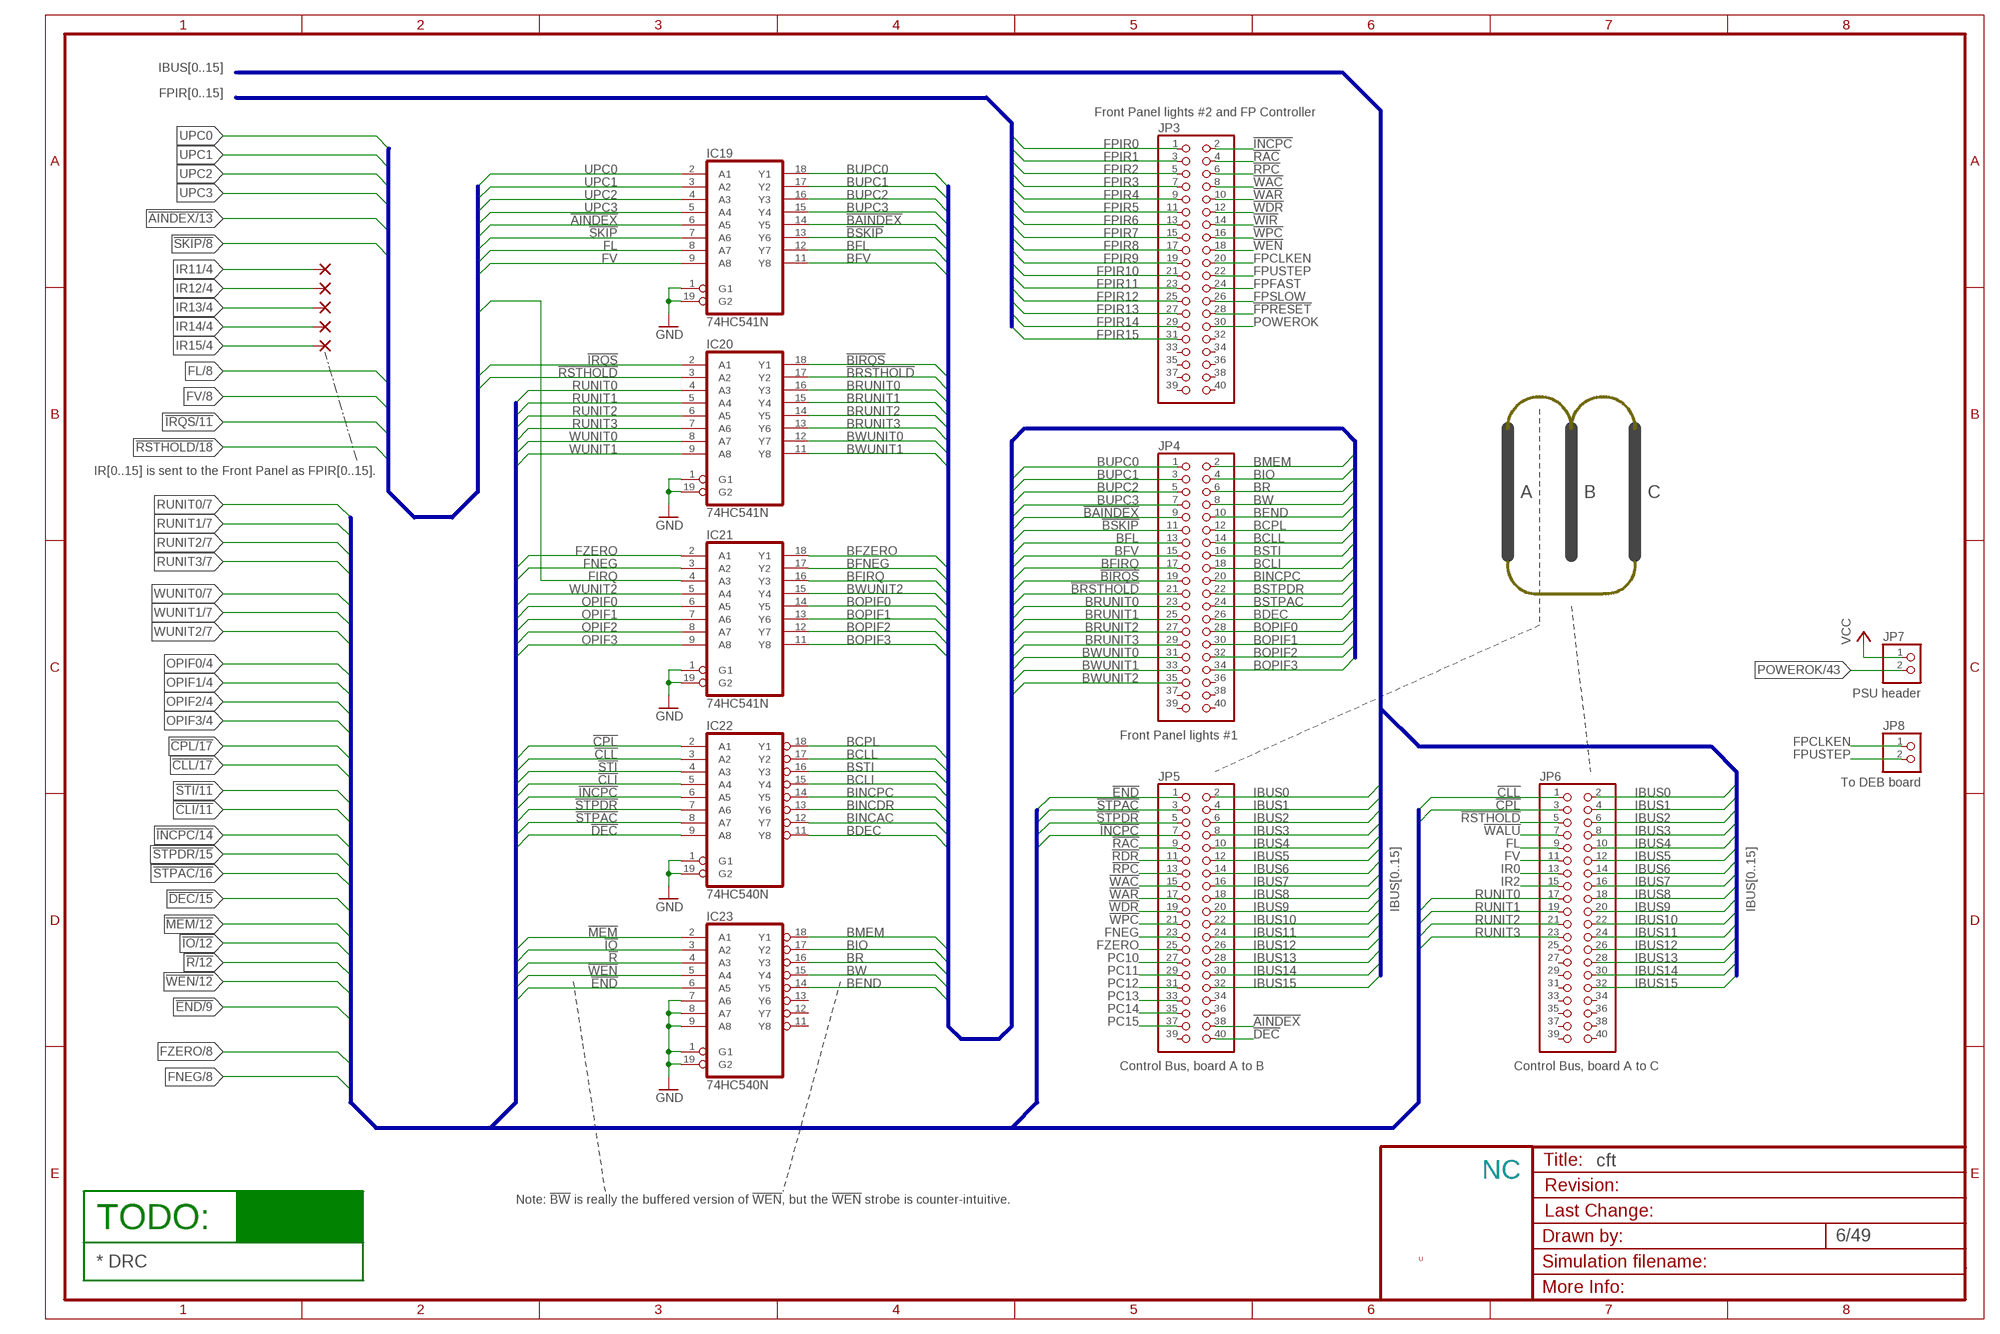
[diagram p5: schematic, sheet 6]

### Parts
IC19  74HC541N  [DIL20]
IC20  74HC541N  [DIL20]
IC21  74HC541N  [DIL20]
IC22  74HC540N  [DIL20]
IC23  74HC540N  [DIL20]
JP3  PINHD-2X20  [2X20]
JP4  PINHD-2X20  [2X20]
JP5  PINHD-2X20  [2X20]
JP6  PINHD-2X20  [2X20]
JP7  PINHD-1X2  [1X02]
JP8  PINHD-1X2  [1X02]
PAD1  1,6/0,8  [1,6/0,8]
PAD2  1,6/0,8  [1,6/0,8]
PAD3  1,6/0,8  [1,6/0,8]
PAD4  1,6/0,8  [1,6/0,8]
PAD5  1,6/0,8  [1,6/0,8]

### Nets
!AINDEX: IC19.6(A5) JP5.38 ; also sheet 4,13
!BAINDEX: IC19.14(Y5) JP4.9 ; also sheet 38,40
!BIRQS: IC20.18(Y1) JP4.19 ; also sheet 37,38,40
!BRSTHOLD: IC20.17(Y2) JP4.21 ; also sheet 38,40
!BSKIP: IC19.13(Y6) JP4.11 ; also sheet 38,40
!CLI: IC22.5(A4) ; also sheet 4,5,11
!CLL: IC22.3(A2) JP6.1 ; also sheet 4,5,17
!CPL: IC22.2(A1) JP6.3 ; also sheet 4,5,17
!DEC: IC22.9(A8) JP5.40 ; also sheet 4,5,15,16
!END: IC23.6(A5) JP5.1 ; also sheet 4,5,9,11,13
!FPRESET: JP3.28 ; also sheet 3,34,40
!INCPC: IC22.6(A5) JP3.2 JP5.7 ; also sheet 4,5,14,42
!IO: IC23.3(A2) ; also sheet 4,5,12,13,42,44,45,46
!IRQS: IC20.2(A1) ; also sheet 4,11,20,40,44,45,46
!MEM: IC23.2(A1) ; also sheet 4,5,12,13,21,24,42,44,45,46
!R: IC23.4(A3) ; also sheet 4,5,12,22,24,25,26,27,28,29,30,41,42,44,45,46,47,48
!RAC: JP3.4 JP5.9 ; also sheet 7,16,42
!RDR: JP5.11 ; also sheet 7,15
!RPC: JP3.6 JP5.13 ; also sheet 7,14,42
!RSTHOLD: IC20.3(A2) JP6.5 ; also sheet 3,4,18
!SKIP: IC19.7(A6) ; also sheet 4,8
!STI: IC22.4(A3) ; also sheet 4,5,11
!STPAC: IC22.8(A7) JP5.3 ; also sheet 4,5,16
!STPDR: IC22.7(A6) JP5.5 ; also sheet 4,5,15
!WAC: JP3.8 JP5.15 ; also sheet 7,16,42
!WALU: JP6.7 ; also sheet 7,18
!WAR: JP3.10 JP5.17 ; also sheet 7,13,42
!WDR: JP3.12 JP5.19 ; also sheet 7,15,42
!WEN: IC23.5(A4) JP3.18 ; also sheet 4,5,12,42
!WIR: JP3.14 ; also sheet 7,10,42
!WPC: JP3.16 JP5.21 ; also sheet 7,14,42
BCLI: IC22.15(Y4) JP4.18 ; also sheet 32,40
BCLL: IC22.17(Y2) JP4.14 ; also sheet 32,40
BCPL: IC22.18(Y1) JP4.12 ; also sheet 32,40
BDEC: IC22.11(Y8) JP4.26
BEND: IC23.14(Y5) JP4.10 ; also sheet 32,40
BFIRQ: IC21.16(Y3) JP4.17 ; also sheet 32,40
BFL: IC19.12(Y7) JP4.13 ; also sheet 32,38,40
BFNEG: IC21.17(Y2) ; also sheet 32
BFV: IC19.11(Y8) JP4.15 ; also sheet 32,38,40
BFZERO: IC21.18(Y1) ; also sheet 32
BINCAC: IC22.12(Y7)
BINCDR: IC22.13(Y6) ; also sheet 32,40
BINCPC: IC22.14(Y5) JP4.20 ; also sheet 32,40
BIO: IC23.17(Y2) JP4.4 ; also sheet 32,40
BMEM: IC23.18(Y1) JP4.2 ; also sheet 32,40
BOPIF0: IC21.14(Y5) JP4.28 ; also sheet 32,40
BOPIF1: IC21.13(Y6) JP4.30 ; also sheet 32,40
BOPIF2: IC21.12(Y7) JP4.32 ; also sheet 32,40
BOPIF3: IC21.11(Y8) JP4.34 ; also sheet 32,40
BR: IC23.16(Y3) JP4.6 ; also sheet 32,40
BRUNIT0: IC20.16(Y3) JP4.23 ; also sheet 32,40
BRUNIT1: IC20.15(Y4) JP4.25 ; also sheet 32,40
BRUNIT2: IC20.14(Y5) JP4.27 ; also sheet 32,40
BRUNIT3: IC20.13(Y6) JP4.29 ; also sheet 32,40
BSTI: IC22.16(Y3) JP4.16 ; also sheet 32,40
BSTPAC: JP4.24 ; also sheet 32,40
BSTPDR: JP4.22
BUPC0: IC19.18(Y1) JP4.1 ; also sheet 38,40
BUPC1: IC19.17(Y2) JP4.3 ; also sheet 38,40
BUPC2: IC19.16(Y3) JP4.5 ; also sheet 38,40
BUPC3: IC19.15(Y4) JP4.7 ; also sheet 38,40
BW: IC23.15(Y4) JP4.8 ; also sheet 32,40
BWUNIT0: IC20.12(Y7) JP4.31 ; also sheet 32,40
BWUNIT1: IC20.11(Y8) JP4.33 ; also sheet 32,40
BWUNIT2: IC21.15(Y4) JP4.35 ; also sheet 32,40
FIRQ: IC21.4(A3) ; also sheet 11
FL: IC19.8(A7) JP6.9 ; also sheet 4,8,17,19,20
FNEG: IC21.3(A2) JP5.23 ; also sheet 5,8,16,40
FPCLKEN: JP3.20 JP8.1 ; also sheet 2,35,43,45
FPFAST: JP3.24 ; also sheet 2,35,40
FPIR0: JP3.1 ; also sheet 10
FPIR1: JP3.3 ; also sheet 10
FPIR2: JP3.5 ; also sheet 10
FPIR3: JP3.7 ; also sheet 10
FPIR4: JP3.9 ; also sheet 10
FPIR5: JP3.11 ; also sheet 10
FPIR6: JP3.13 ; also sheet 10
FPIR7: JP3.15 ; also sheet 10
FPIR8: JP3.17 ; also sheet 10
FPIR9: JP3.19 ; also sheet 10
FPIR10: JP3.21 ; also sheet 10
FPIR11: JP3.23 ; also sheet 10
FPIR12: JP3.25 ; also sheet 10
FPIR13: JP3.27 ; also sheet 10
FPIR14: JP3.29 ; also sheet 10
FPIR15: JP3.31 ; also sheet 10
FPSLOW: JP3.26 ; also sheet 2,35,40
FPUSTEP: JP3.22 JP8.2 ; also sheet 2,35,40,45
FV: IC19.9(A8) JP6.11 ; also sheet 4,8,19
FZERO: IC21.2(A1) JP5.25 ; also sheet 5,8,16,40
GND [low power]: IC19.1(G1) IC19.19(G2) IC20.1(G1) IC20.19(G2) IC21.1(G1) IC21.19(G2) IC22.1(G1) IC22.19(G2) IC23.1(G1) IC23.7(A6) IC23.8(A7) IC23.9(A8) IC23.19(G2) ; also sheet 2,3,4,5,7,8,9,10,11,12,13,14,15,16,17,18,19,20,21,22,24,25,26,27,28,29,30,31,32,33,34,35,36,37,38,39,40,41,42,43,44,45,46,47,48,49
IBUS0: JP5.2 JP6.2 ; also sheet 3,9,10,12,13,14,15,16,18,20
IBUS1: JP5.4 JP6.4 ; also sheet 3,9,10,12,13,14,15,16,18,20
IBUS2: JP5.6 JP6.6 ; also sheet 3,9,10,12,13,14,15,16,18,20
IBUS3: JP5.8 JP6.8 ; also sheet 3,9,10,12,13,14,15,16,18,20
IBUS4: JP5.10 JP6.10 ; also sheet 3,9,10,12,13,14,15,16,18,20
IBUS5: JP5.12 JP6.12 ; also sheet 3,9,10,12,13,14,15,16,18,20
IBUS6: JP5.14 JP6.14 ; also sheet 3,9,10,12,13,14,15,16,18,20
IBUS7: JP5.16 JP6.16 ; also sheet 3,9,10,12,13,14,15,16,18,20
IBUS8: JP5.18 JP6.18 ; also sheet 3,9,10,12,13,14,15,16,18,20
IBUS9: JP5.20 JP6.20 ; also sheet 3,9,10,12,13,14,15,16,18,20
IBUS10: JP5.22 JP6.22 ; also sheet 3,9,10,12,13,14,15,16,18,20
IBUS11: JP5.24 JP6.24 ; also sheet 3,9,10,12,13,14,15,16,18,20
IBUS12: JP5.26 JP6.26 ; also sheet 3,9,10,12,13,14,15,16,18,20
IBUS13: JP5.28 JP6.28 ; also sheet 3,9,10,12,13,14,15,16,18,20
IBUS14: JP5.30 JP6.30 ; also sheet 3,9,10,12,13,14,15,16,18,20
IBUS15: JP5.32 JP6.32 ; also sheet 3,9,10,12,13,14,15,16,18,20
IR0: JP6.13 ; also sheet 8,9,10,18,32
IR2: JP6.15 ; also sheet 8,9,10,18,32
IR11: PAD1.1(P) ; also sheet 4,10,32,38
IR12: PAD2.1(P) ; also sheet 4,10,32,38
IR13: PAD3.1(P) ; also sheet 4,10,32,38
IR14: PAD4.1(P) ; also sheet 4,10,32,38
IR15: PAD5.1(P) ; also sheet 4,10,32,38
OPIF0: IC21.6(A5) ; also sheet 4,5,8
OPIF1: IC21.7(A6) ; also sheet 4,5,8
OPIF2: IC21.8(A7) ; also sheet 4,5,8
OPIF3: IC21.9(A8) ; also sheet 4,5,8
PC10: JP5.27 ; also sheet 9,14,32
PC11: JP5.29 ; also sheet 9,14,32
PC12: JP5.31 ; also sheet 9,14,32
PC13: JP5.33 ; also sheet 9,14,32
PC14: JP5.35 ; also sheet 9,14,32
PC15: JP5.37 ; also sheet 9,14,32
POWEROK: JP3.30 JP7.2 ; also sheet 3,40,43
RUNIT0: IC20.4(A3) JP6.17 ; also sheet 4,5,7,18,19
RUNIT1: IC20.5(A4) JP6.19 ; also sheet 4,5,7,18,19
RUNIT2: IC20.6(A5) JP6.21 ; also sheet 4,5,7,18
RUNIT3: IC20.7(A6) JP6.23 ; also sheet 4,5,7,18
UPC0: IC19.2(A1) ; also sheet 4
UPC1: IC19.3(A2) ; also sheet 4
UPC2: IC19.4(A3) ; also sheet 4
UPC3: IC19.5(A4) ; also sheet 4
VCC [low power]: JP7.1 ; also sheet 2,3,4,7,8,9,10,11,12,13,14,15,16,17,18,19,20,21,22,24,25,26,27,28,29,30,31,34,35,36,37,38,39,40,41,42,43,44,45,46,47,48,49
WUNIT0: IC20.8(A7) ; also sheet 4,5,7
WUNIT1: IC20.9(A8) ; also sheet 4,5,7
WUNIT2: IC21.5(A4) ; also sheet 4,5,7
Unconnected: IC23.11(Y8) IC23.12(Y7) IC23.13(Y6) JP3.32 JP3.33 JP3.34 JP3.35 JP3.36 JP3.37 JP3.38 JP3.39 JP3.40 JP4.36 JP4.37 JP4.38 JP4.39 JP4.40 JP5.34 JP5.36 JP5.39 JP6.25 JP6.27 JP6.29 JP6.31 JP6.33 JP6.34 JP6.35 JP6.36 JP6.37 JP6.38 JP6.39 JP6.40

### Buses
MCADDR:UPC[0..3],!AINDEX,!SKIP,IR[11..15],FL,FV,FIRQ,!IRQS,!RSTHOLD
MCINSTR:RUNIT[0..3],WUNIT[0..2],OPIF[0..3],!CPL,!CLL,!STI,!CLI,!INCPC,!STPDR,!STPAC,!DEC,!MEM,!IO,!R,!W,!END
BMCINSTR:BRUNIT[0..3],BWUNIT[0..2],BOPIF[0..3],BCPL,BCLL,BSTI,BCLI,BINCPC,BSTPDR,BSTPAC,BDEC,BMEM,BIO,BR,BW,BEND
FPIR[0..15]
IBUS[0..15]

### Notes on the sheet
- Front Panel lights #2 and FP Controller
- IR[0..15] is sent to the Front Panel as FPIR[0..15].
- A | B | C
- PSU header
- Front Panel lights #1
- To DEB board
- Control Bus, board A to B | Control Bus, board A to C
- NC
- Note: !BW! is really the buffered version of !WEN!, but the !WEN! strobe is counter-intuitive.
- TODO:
- U
- * DRC

## Sheet 7 of 49
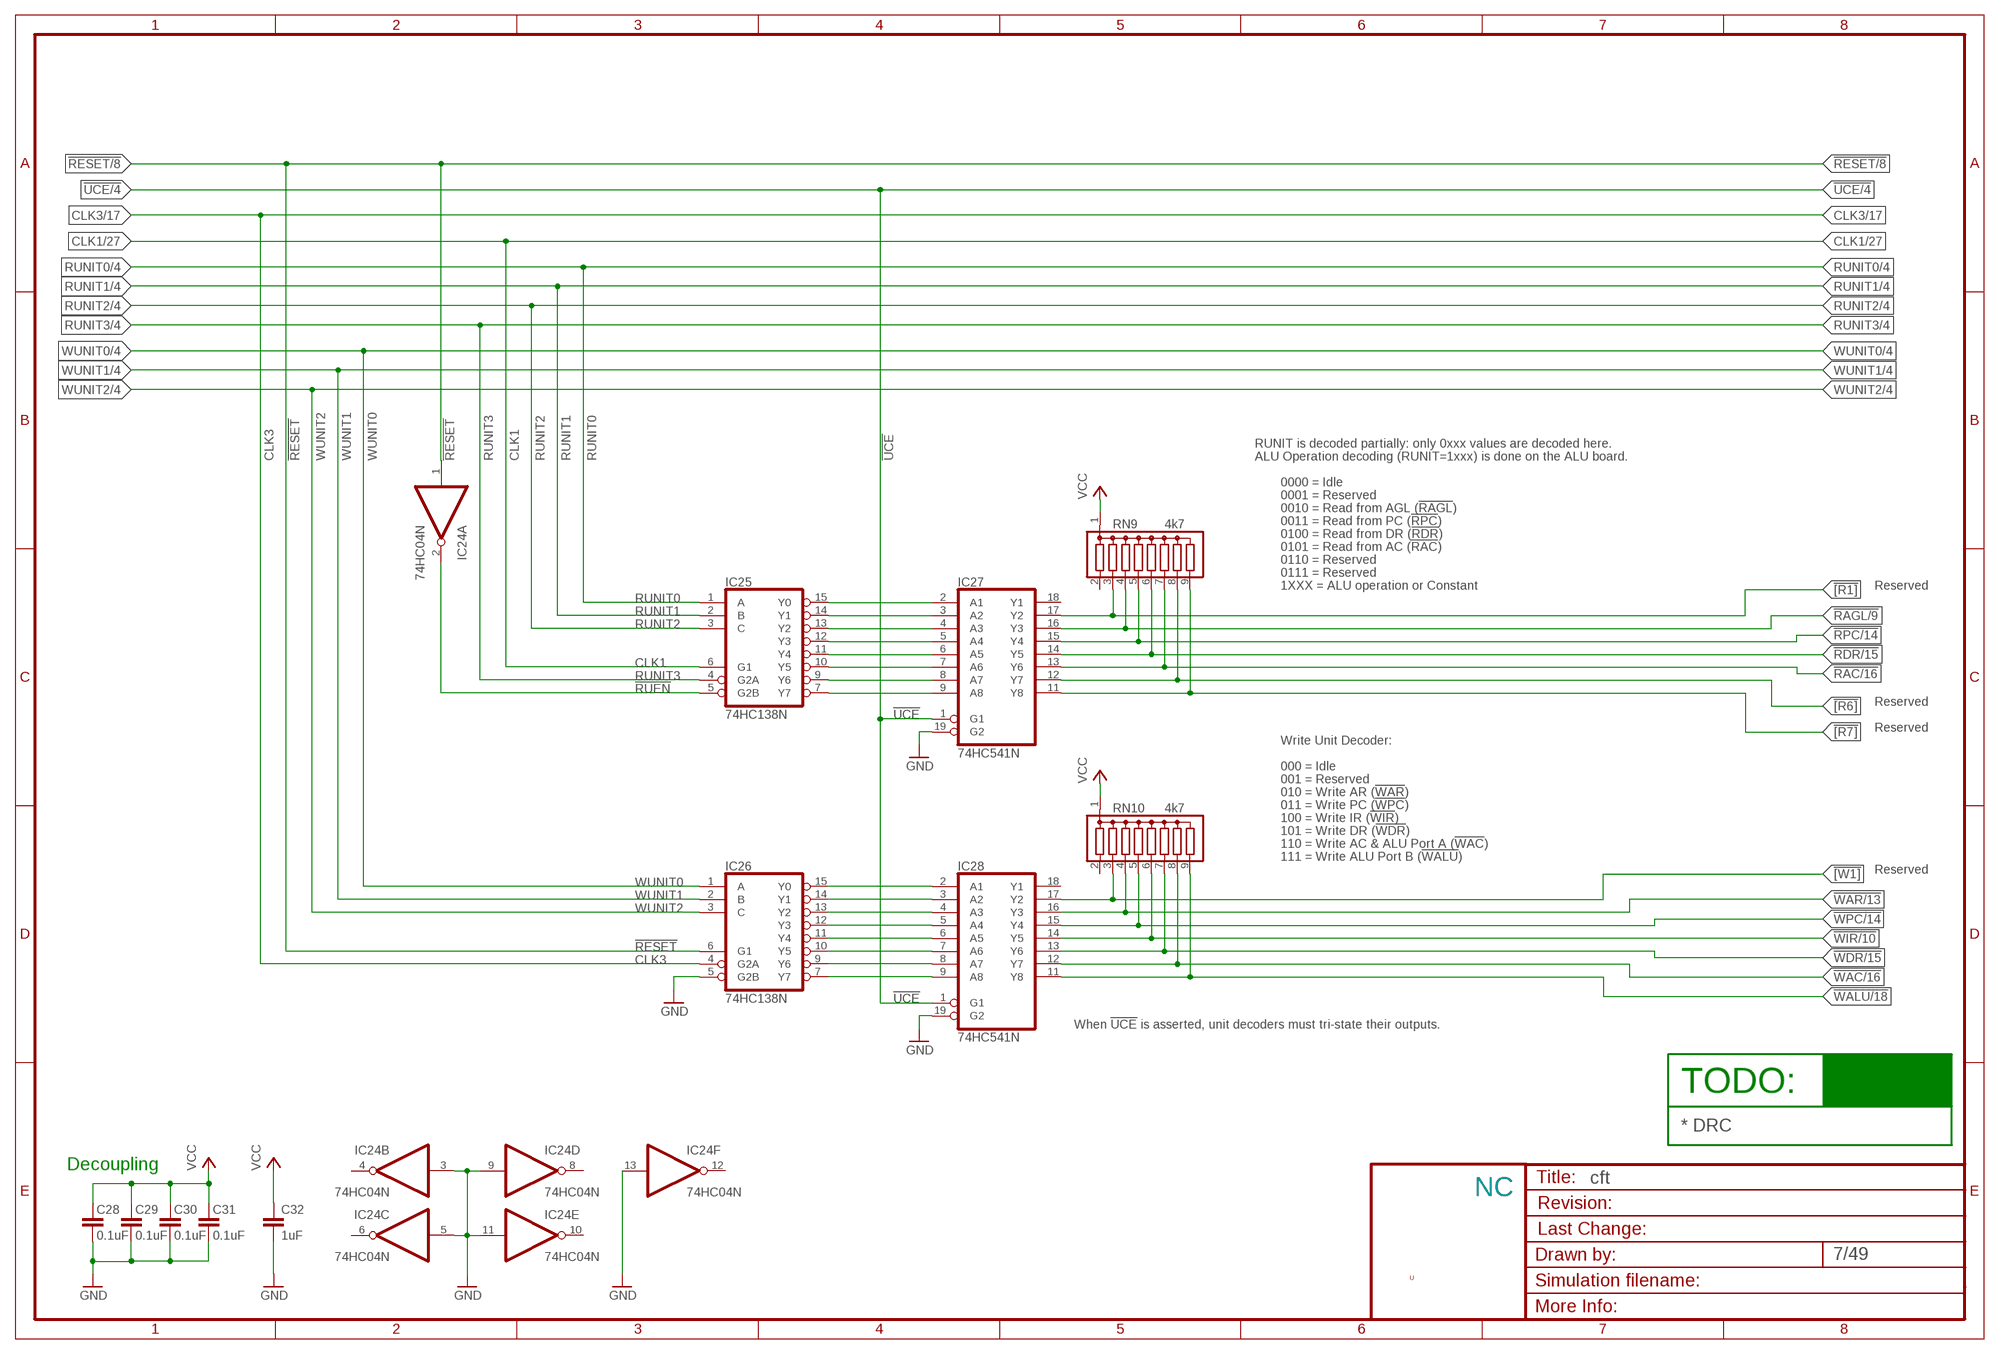
[diagram p6: schematic, sheet 7]

### Parts
C28  0.1uF  C-EU025-024X044  [C025-024X044]
C29  0.1uF  C-EU025-024X044  [C025-024X044]
C30  0.1uF  C-EU025-024X044  [C025-024X044]
C31  0.1uF  C-EU025-024X044  [C025-024X044]
C32  1uF  C-EU025-024X044  [C025-024X044]
IC24  74HC04N  [DIL14]
IC25  74HC138N  [DIL16]
IC26  74HC138N  [DIL16]
IC27  74HC541N  [DIL20]
IC28  74HC541N  [DIL20]
RN9  4k7  G08R  [SIL9]
RN10  4k7  G08R  [SIL9]

### Nets
![R1]: IC27.17(Y2) RN9.3
![R6]: IC27.12(Y7) RN9.8
![R7]: IC27.11(Y8) RN9.9
![W1]: IC28.17(Y2) RN10.3
!RAC: IC27.13(Y6) RN9.7 ; also sheet 6,16,42
!RAGL: IC27.16(Y3) RN9.4 ; also sheet 9
!RDR: IC27.14(Y5) RN9.6 ; also sheet 6,15
!RESET: IC24.1(A:I) IC26.6(G1) ; also sheet 2,3,4,8,10,11,12,13,14,17,18,19,20,21,22,25,26,28,29,30,31,44,45,46,47
!RPC: IC27.15(Y4) RN9.5 ; also sheet 6,14,42
!RUEN: IC24.2(A:O) IC25.5(G2B)
!UCE: IC27.1(G1) IC28.1(G1) ; also sheet 4
!WAC: IC28.12(Y7) RN10.8 ; also sheet 6,16,42
!WALU: IC28.11(Y8) RN10.9 ; also sheet 6,18
!WAR: IC28.16(Y3) RN10.4 ; also sheet 6,13,42
!WDR: IC28.13(Y6) RN10.7 ; also sheet 6,15,42
!WIR: IC28.14(Y5) RN10.6 ; also sheet 6,10,42
!WPC: IC28.15(Y4) RN10.5 ; also sheet 6,14,42
CLK1: IC25.6(G1) ; also sheet 2,27,31,43,44,45,46
CLK3: IC26.4(G2A) ; also sheet 2,3,17,19,44,45,46
GND [low power]: C28.1 C29.1 C30.1 C31.1 C32.2 IC24.3(B:I) IC24.5(C:I) IC24.9(D:I) IC24.11(E:I) IC24.13(F:I) IC26.5(G2B) IC27.19(G2) IC28.19(G2) ; also sheet 2,3,4,5,6,8,9,10,11,12,13,14,15,16,17,18,19,20,21,22,24,25,26,27,28,29,30,31,32,33,34,35,36,37,38,39,40,41,42,43,44,45,46,47,48,49
N$458: IC25.7(Y7) IC27.9(A8)
N$459: IC25.9(Y6) IC27.8(A7)
N$460: IC25.10(Y5) IC27.7(A6)
N$461: IC25.11(Y4) IC27.6(A5)
N$463: IC25.12(Y3) IC27.5(A4)
N$464: IC25.13(Y2) IC27.4(A3)
N$465: IC25.14(Y1) IC27.3(A2)
N$466: IC25.15(Y0) IC27.2(A1)
N$483: IC26.15(Y0) IC28.2(A1)
N$484: IC26.14(Y1) IC28.3(A2)
N$485: IC26.13(Y2) IC28.4(A3)
N$486: IC26.12(Y3) IC28.5(A4)
N$487: IC26.11(Y4) IC28.6(A5)
N$488: IC26.10(Y5) IC28.7(A6)
N$505: IC26.9(Y6) IC28.8(A7)
N$506: IC26.7(Y7) IC28.9(A8)
RUNIT0: IC25.1(A) ; also sheet 4,5,6,18,19
RUNIT1: IC25.2(B) ; also sheet 4,5,6,18,19
RUNIT2: IC25.3(C) ; also sheet 4,5,6,18
RUNIT3: IC25.4(G2A) ; also sheet 4,5,6,18
VCC [low power]: C28.2 C29.2 C30.2 C31.2 C32.1 RN9.1 RN10.1 ; also sheet 2,3,4,6,8,9,10,11,12,13,14,15,16,17,18,19,20,21,22,24,25,26,27,28,29,30,31,34,35,36,37,38,39,40,41,42,43,44,45,46,47,48,49
WUNIT0: IC26.1(A) ; also sheet 4,5,6
WUNIT1: IC26.2(B) ; also sheet 4,5,6
WUNIT2: IC26.3(C) ; also sheet 4,5,6
Unconnected: IC24.4(B:O) IC24.6(C:O) IC24.8(D:O) IC24.10(E:O) IC24.12(F:O) IC27.18(Y1) IC28.18(Y1) RN9.2 RN10.2

### Notes on the sheet
- RUNIT is decoded partially: only 0xxx values are decoded here.
- ALU Operation decoding (RUNIT=1xxx) is done on the ALU board.
- 0000 = Idle
- 0001 = Reserved
- 0010 = Read from AGL (!RAGL!)
- 0011 = Read from PC (!RPC!)
- 0100 = Read from DR (!RDR!)
- 0101 = Read from AC (!RAC!)
- 0110 = Reserved
- 0111 = Reserved
- 1XXX = ALU operation or Constant | Reserved
- Reserved
- Reserved
- Write Unit Decoder:
- 000 = Idle
- 001 = Reserved
- 010 = Write AR (!WAR!)
- 011 = Write PC (!WPC!)
- 100 = Write IR (!WIR!)
- 101 = Write DR (!WDR!)
- 110 = Write AC & ALU Port A (!WAC!)
- 111 = Write ALU Port B (!WALU!)
- Reserved
- When !UCE! is asserted, unit decoders must tri-state their outputs.
- TODO:
- * DRC
- Decoupling
- NC
- U

## Sheet 8 of 49
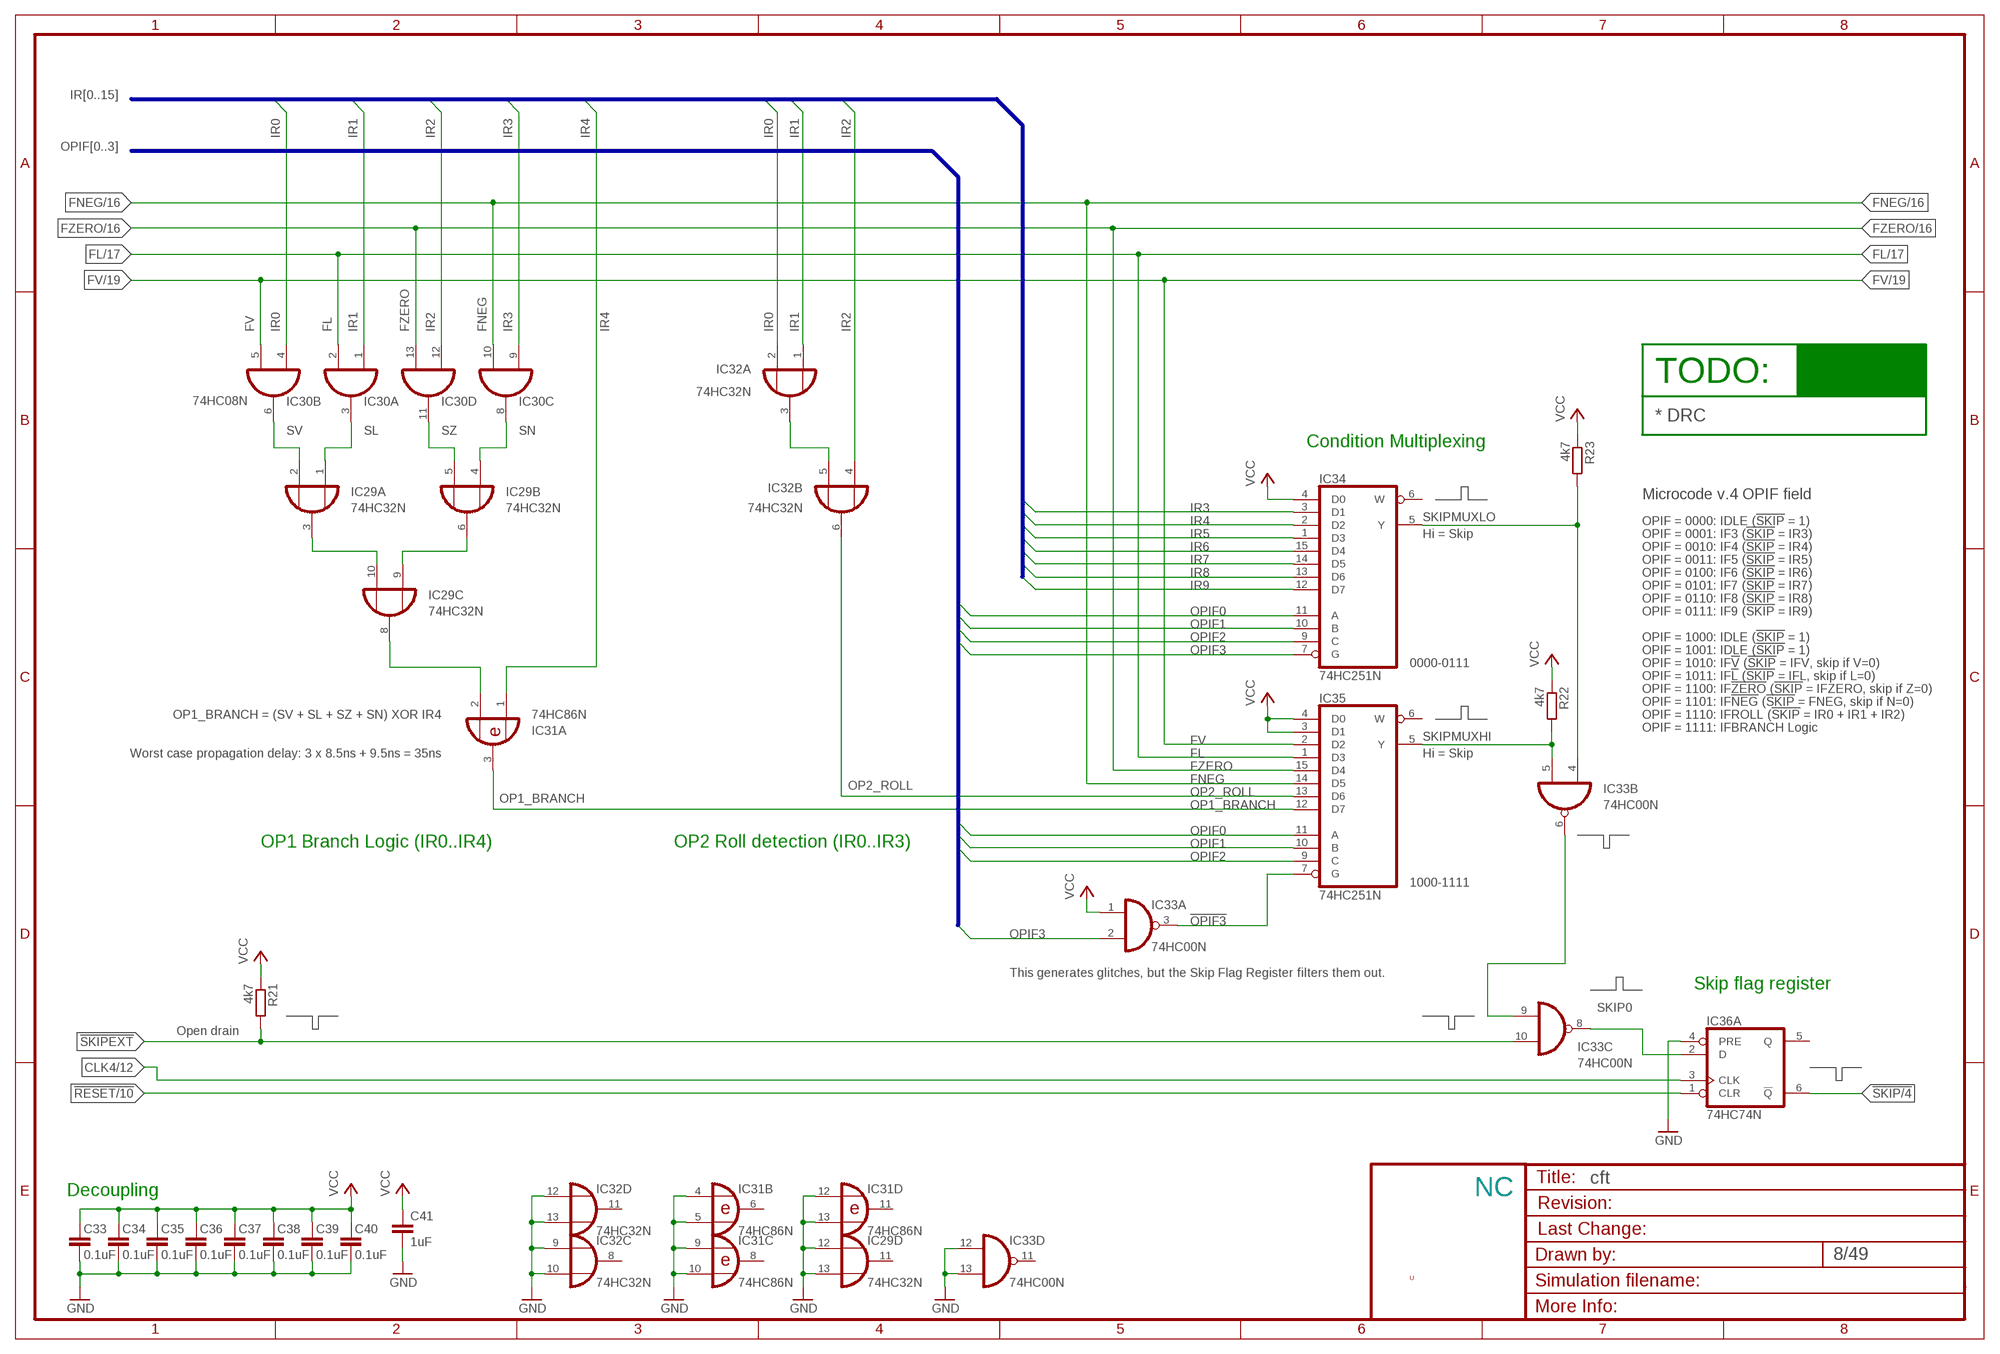
[diagram p7: schematic, sheet 8]

### Parts
C33  0.1uF  C-EU025-024X044  [C025-024X044]
C34  0.1uF  C-EU025-024X044  [C025-024X044]
C35  0.1uF  C-EU025-024X044  [C025-024X044]
C36  0.1uF  C-EU025-024X044  [C025-024X044]
C37  0.1uF  C-EU025-024X044  [C025-024X044]
C38  0.1uF  C-EU025-024X044  [C025-024X044]
C39  0.1uF  C-EU025-024X044  [C025-024X044]
C40  0.1uF  C-EU025-024X044  [C025-024X044]
C41  1uF  C-EU025-024X044  [C025-024X044]
IC29  74HC32N  [DIL14]
IC30  74HC08N  [DIL14]
IC31  74HC86N  [DIL14]
IC32  74HC32N  [DIL14]
IC33  74HC00N  [DIL14]
IC34  74HC251N  [DIL16]
IC35  74HC251N  [DIL16]
IC36  74HC74N  [DIL14]
R21  4k7  R-EU_0204/7  [0204/7]
R22  4k7  R-EU_0204/7  [0204/7]
R23  4k7  R-EU_0204/7  [0204/7]

### Nets
!OPIF3: IC33.3(A:O) IC35.7(G)
!RESET: IC36.1(A:CLR) ; also sheet 2,3,4,7,10,11,12,13,14,17,18,19,20,21,22,25,26,28,29,30,31,44,45,46,47
!SKIP: IC36.6(A:!Q) ; also sheet 4,6
!SKIPEXT: IC33.10(C:I1) R21.2 ; also sheet 44,45,46
CLK4: IC36.3(A:CLK) ; also sheet 2,4,12,44,45,46
FL: IC30.2(A:I1) IC35.1(D3) ; also sheet 4,6,17,19,20
FNEG: IC30.10(C:I1) IC35.14(D5) ; also sheet 5,6,16,40
FV: IC30.5(B:I1) IC35.2(D2) ; also sheet 4,6,19
FZERO: IC30.13(D:I1) IC35.15(D4) ; also sheet 5,6,16,40
GND [low power]: C33.1 C34.1 C35.1 C36.1 C37.1 C38.1 C39.1 C40.1 C41.2 IC29.12(D:I0) IC29.13(D:I1) IC31.4(B:I0) IC31.5(B:I1) IC31.9(C:I0) IC31.10(C:I1) IC31.12(D:I0) IC31.13(D:I1) IC32.9(C:I0) IC32.10(C:I1) IC32.12(D:I0) IC32.13(D:I1) IC33.12(D:I0) IC33.13(D:I1) IC36.4(A:PRE) ; also sheet 2,3,4,5,6,7,9,10,11,12,13,14,15,16,17,18,19,20,21,22,24,25,26,27,28,29,30,31,32,33,34,35,36,37,38,39,40,41,42,43,44,45,46,47,48,49
IR0: IC30.4(B:I0) IC32.2(A:I1) ; also sheet 6,9,10,18,32
IR1: IC30.1(A:I0) IC32.1(A:I0) ; also sheet 9,10,32
IR2: IC30.12(D:I0) IC32.4(B:I0) ; also sheet 6,9,10,18,32
IR3: IC30.9(C:I0) IC34.3(D1) ; also sheet 9,10,32
IR4: IC31.1(A:I0) IC34.2(D2) ; also sheet 9,10,32
IR5: IC34.1(D3) ; also sheet 9,10,32
IR6: IC34.15(D4) ; also sheet 9,10,32
IR7: IC34.14(D5) ; also sheet 9,10,32
IR8: IC34.13(D6) ; also sheet 9,10,32
IR9: IC34.12(D7) ; also sheet 9,10,32
N$66: IC29.3(A:O) IC29.10(C:I1)
N$89: IC29.8(C:O) IC31.2(A:I1)
N$90: IC29.6(B:O) IC29.9(C:I0)
N$93: IC32.3(A:O) IC32.5(B:I1)
N$94: IC33.6(B:O) IC33.9(C:I0)
OP1_BRANCH: IC31.3(A:O) IC35.12(D7)
OP2_ROLL: IC32.6(B:O) IC35.13(D6)
OPIF0: IC34.11(A) IC35.11(A) ; also sheet 4,5,6
OPIF1: IC34.10(B) IC35.10(B) ; also sheet 4,5,6
OPIF2: IC34.9(C) IC35.9(C) ; also sheet 4,5,6
OPIF3: IC33.2(A:I1) IC34.7(G) ; also sheet 4,5,6
SKIP0: IC33.8(C:O) IC36.2(A:D)
SKIPMUXHI: IC33.5(B:I1) IC35.5(Y) R22.2
SKIPMUXLO: IC33.4(B:I0) IC34.5(Y) R23.2
SL: IC29.1(A:I0) IC30.3(A:O)
SN: IC29.4(B:I0) IC30.8(C:O)
SV: IC29.2(A:I1) IC30.6(B:O)
SZ: IC29.5(B:I1) IC30.11(D:O)
VCC [low power]: C33.2 C34.2 C35.2 C36.2 C37.2 C38.2 C39.2 C40.2 C41.1 IC33.1(A:I0) IC34.4(D0) IC35.3(D1) IC35.4(D0) R21.1 R22.1 R23.1 ; also sheet 2,3,4,6,7,9,10,11,12,13,14,15,16,17,18,19,20,21,22,24,25,26,27,28,29,30,31,34,35,36,37,38,39,40,41,42,43,44,45,46,47,48,49
Unconnected: IC29.11(D:O) IC31.6(B:O) IC31.8(C:O) IC31.11(D:O) IC32.8(C:O) IC32.11(D:O) IC33.11(D:O) IC34.6(W) IC35.6(W) IC36.5(A:Q)

### Buses
IR[0..15]
OPIF[0..3]

### Notes on the sheet
- TODO:
- * DRC
- Condition Multiplexing
- Microcode v.4 OPIF field
- OPIF = 0000: IDLE (!SKIP! = 1)
- Hi = Skip | OPIF = 0001: IF3 (!SKIP! = IR3)
- OPIF = 0010: IF4 (!SKIP! = IR4)
- OPIF = 0011: IF5 (!SKIP! = IR5)
- OPIF = 0100: IF6 (!SKIP! = IR6)
- OPIF = 0101: IF7 (!SKIP! = IR7)
- OPIF = 0110: IF8 (!SKIP! = IR8)
- OPIF = 0111: IF9 (!SKIP! = IR9)
- OPIF = 1000: IDLE (!SKIP! = 1)
- OPIF = 1001: IDLE (!SKIP! = 1)
- 0000-0111 | OPIF = 1010: IF!V! (!SKIP! = IFV, skip if V=0)
- OPIF = 1011: IF!L! (!SKIP! = IFL, skip if L=0)
- OPIF = 1100: IF!ZERO! (!SKIP! = IFZERO, skip if Z=0)
- OPIF = 1101: IF!NEG! (!SKIP! = FNEG, skip if N=0)
- OP1_BRANCH = (SV + SL + SZ + SN) XOR IR4 | OPIF = 1110: IFROLL (!SKIP! = IR0 + IR1 + IR2)
- OPIF = 1111: IFBRANCH Logic
- Worst case propagation delay: 3 x 8.5ns + 9.5ns = 35ns | Hi = Skip
- OP1 Branch Logic (IR0..IR4) | OP2 Roll detection (IR0..IR3)
- 1000-1111
- This generates glitches, but the Skip Flag Register filters them out.
- Skip flag register
- Open drain
- Decoupling | NC
- U

## Sheet 9 of 49
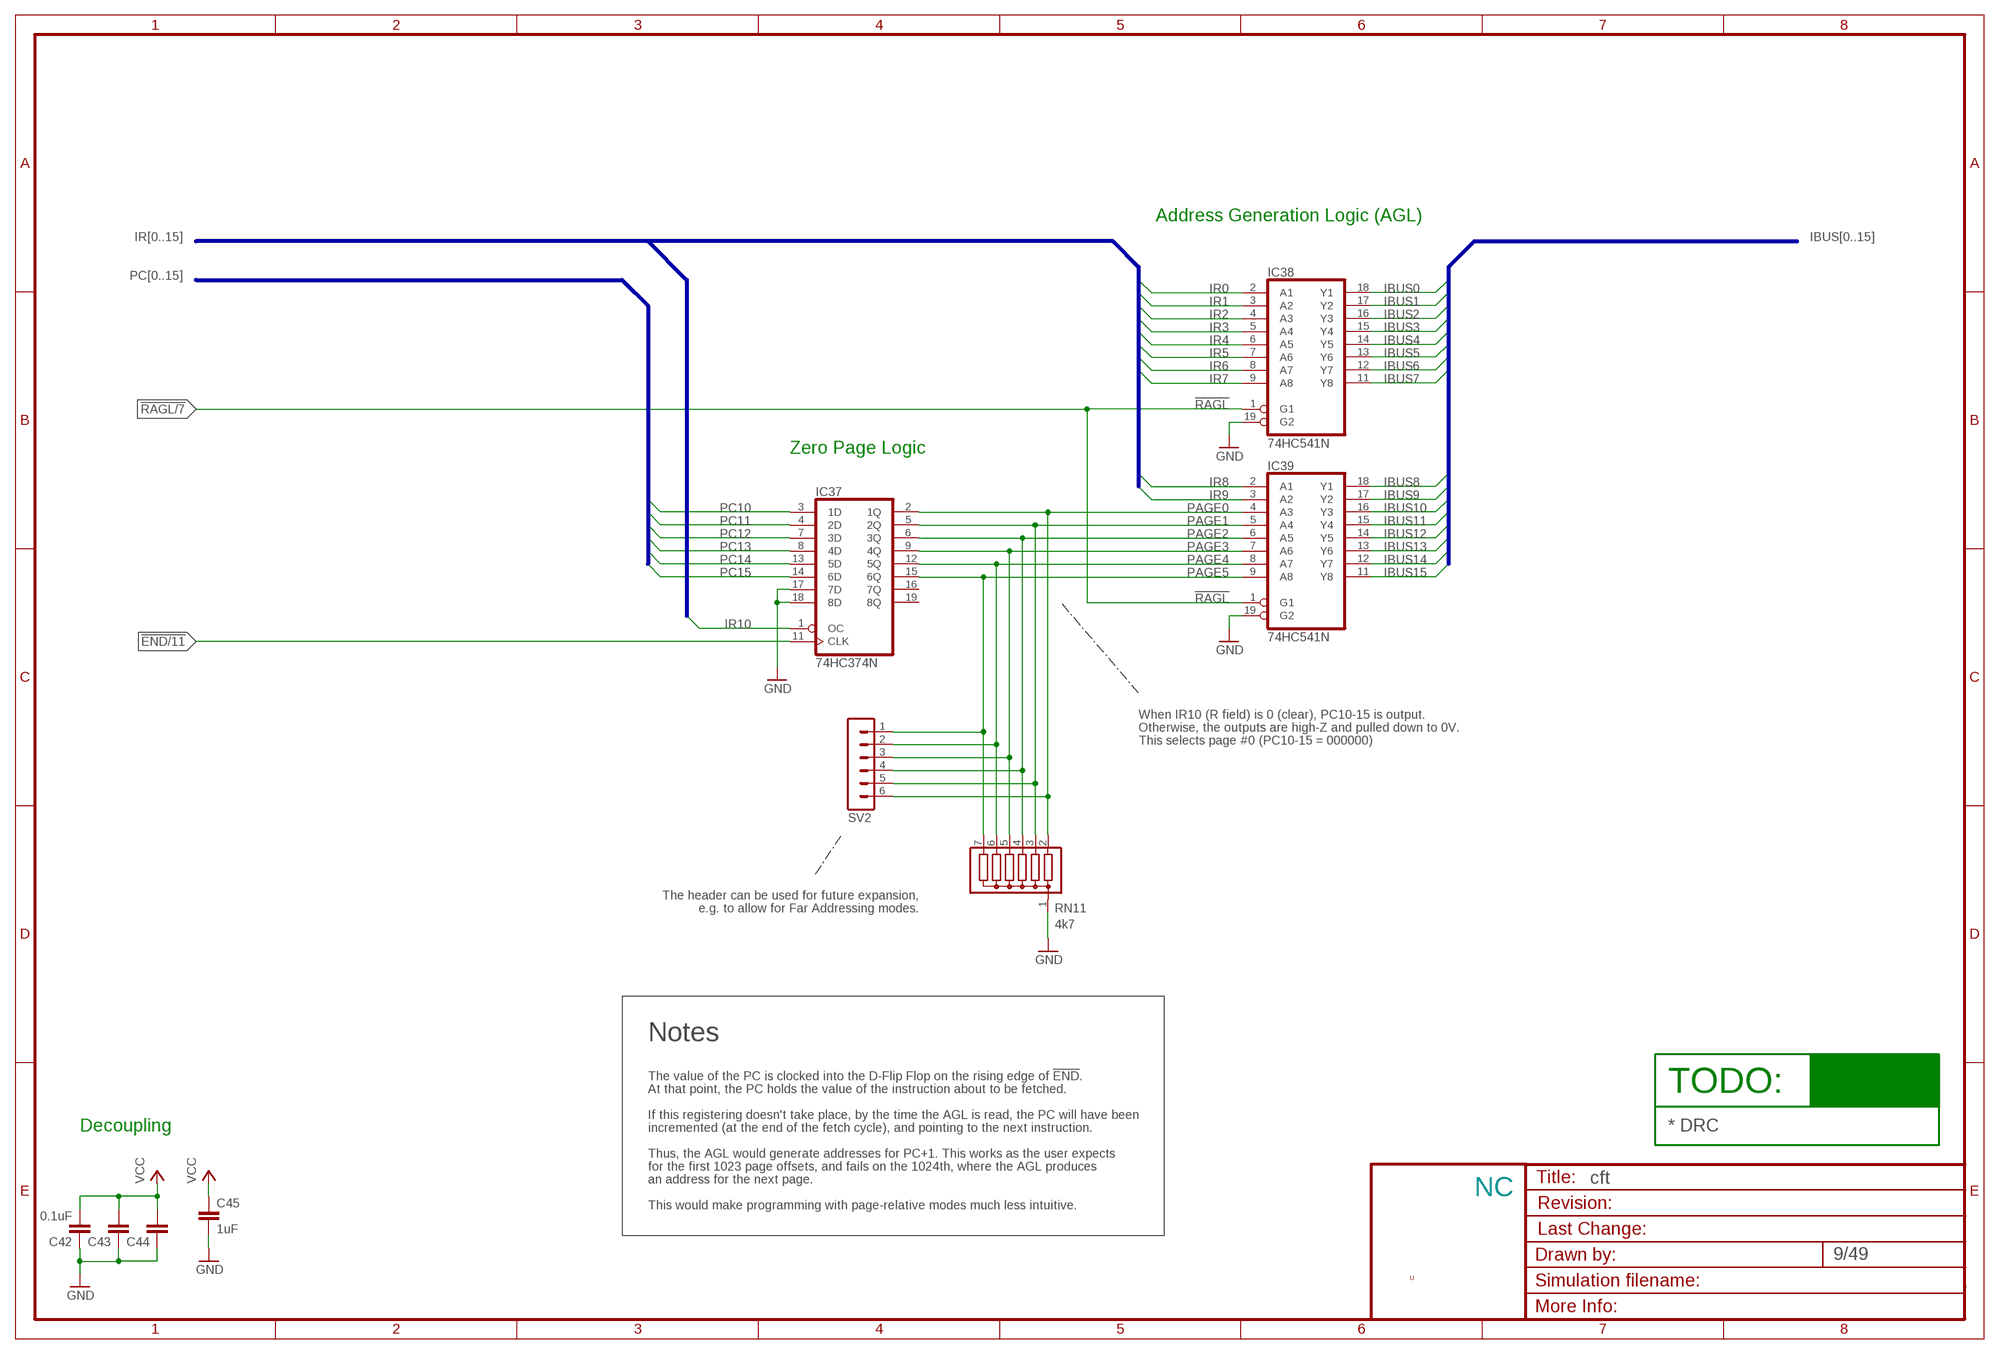
[diagram p8: schematic, sheet 9]

### Parts
C42  0.1uF  C-EU025-024X044  [C025-024X044]
C43  0.1uF  C-EU025-024X044  [C025-024X044]
C44  0.1uF  C-EU025-024X044  [C025-024X044]
C45  1uF  C-EU025-024X044  [C025-024X044]
IC37  74HC374N  [DIL20]
IC38  74HC541N  [DIL20]
IC39  74HC541N  [DIL20]
RN11  4k7  G06R  [SIL7]
SV2  MA06-1  [MA06-1]

### Nets
!END: IC37.11(CLK) ; also sheet 4,5,6,11,13
!RAGL: IC38.1(G1) IC39.1(G1) ; also sheet 7
GND [low power]: C42.1 C43.1 C44.1 C45.2 IC37.17(7D) IC37.18(8D) IC38.19(G2) IC39.19(G2) RN11.1 ; also sheet 2,3,4,5,6,7,8,10,11,12,13,14,15,16,17,18,19,20,21,22,24,25,26,27,28,29,30,31,32,33,34,35,36,37,38,39,40,41,42,43,44,45,46,47,48,49
IBUS0: IC38.18(Y1) ; also sheet 3,6,10,12,13,14,15,16,18,20
IBUS1: IC38.17(Y2) ; also sheet 3,6,10,12,13,14,15,16,18,20
IBUS2: IC38.16(Y3) ; also sheet 3,6,10,12,13,14,15,16,18,20
IBUS3: IC38.15(Y4) ; also sheet 3,6,10,12,13,14,15,16,18,20
IBUS4: IC38.14(Y5) ; also sheet 3,6,10,12,13,14,15,16,18,20
IBUS5: IC38.13(Y6) ; also sheet 3,6,10,12,13,14,15,16,18,20
IBUS6: IC38.12(Y7) ; also sheet 3,6,10,12,13,14,15,16,18,20
IBUS7: IC38.11(Y8) ; also sheet 3,6,10,12,13,14,15,16,18,20
IBUS8: IC39.18(Y1) ; also sheet 3,6,10,12,13,14,15,16,18,20
IBUS9: IC39.17(Y2) ; also sheet 3,6,10,12,13,14,15,16,18,20
IBUS10: IC39.16(Y3) ; also sheet 3,6,10,12,13,14,15,16,18,20
IBUS11: IC39.15(Y4) ; also sheet 3,6,10,12,13,14,15,16,18,20
IBUS12: IC39.14(Y5) ; also sheet 3,6,10,12,13,14,15,16,18,20
IBUS13: IC39.13(Y6) ; also sheet 3,6,10,12,13,14,15,16,18,20
IBUS14: IC39.12(Y7) ; also sheet 3,6,10,12,13,14,15,16,18,20
IBUS15: IC39.11(Y8) ; also sheet 3,6,10,12,13,14,15,16,18,20
IR0: IC38.2(A1) ; also sheet 6,8,10,18,32
IR1: IC38.3(A2) ; also sheet 8,10,32
IR2: IC38.4(A3) ; also sheet 6,8,10,18,32
IR3: IC38.5(A4) ; also sheet 8,10,32
IR4: IC38.6(A5) ; also sheet 8,10,32
IR5: IC38.7(A6) ; also sheet 8,10,32
IR6: IC38.8(A7) ; also sheet 8,10,32
IR7: IC38.9(A8) ; also sheet 8,10,32
IR8: IC39.2(A1) ; also sheet 8,10,32
IR9: IC39.3(A2) ; also sheet 8,10,32
IR10: IC37.1(OC) ; also sheet 10,32
PAGE0: IC37.2(1Q) IC39.4(A3) RN11.2 SV2.6
PAGE1: IC37.5(2Q) IC39.5(A4) RN11.3 SV2.5
PAGE2: IC37.6(3Q) IC39.6(A5) RN11.4 SV2.4
PAGE3: IC37.9(4Q) IC39.7(A6) RN11.5 SV2.3
PAGE4: IC37.12(5Q) IC39.8(A7) RN11.6 SV2.2
PAGE5: IC37.15(6Q) IC39.9(A8) RN11.7 SV2.1
PC10: IC37.3(1D) ; also sheet 6,14,32
PC11: IC37.4(2D) ; also sheet 6,14,32
PC12: IC37.7(3D) ; also sheet 6,14,32
PC13: IC37.8(4D) ; also sheet 6,14,32
PC14: IC37.13(5D) ; also sheet 6,14,32
PC15: IC37.14(6D) ; also sheet 6,14,32
VCC [low power]: C42.2 C43.2 C44.2 C45.1 ; also sheet 2,3,4,6,7,8,10,11,12,13,14,15,16,17,18,19,20,21,22,24,25,26,27,28,29,30,31,34,35,36,37,38,39,40,41,42,43,44,45,46,47,48,49
Unconnected: IC37.16(7Q) IC37.19(8Q)

### Buses
IBUS[0..15]
IR[0..15]
PC[0..15]

### Notes on the sheet
- Address Generation Logic (AGL)
- Zero Page Logic
- When IR10 (R field) is 0 (clear), PC10-15 is output.
- Otherwise, the outputs are high-Z and pulled down to 0V.
- This selects page #0 (PC10-15 = 000000)
- The header can be used for future expansion,
- e.g. to allow for Far Addressing modes.
- Notes
- The value of the PC is clocked into the D-Flip Flop on the rising edge of !END!.
- At that point, the PC holds the value of the instruction about to be fetched. | TODO:
- If this registering doesn't take place, by the time the AGL is read, the PC will have been
- Decoupling | incremented (at the end of the fetch cycle), and pointing to the next instruction. | * DRC
- Thus, the AGL would generate addresses for PC+1. This works as the user expects
- for the first 1023 page offsets, and fails on the 1024th, where the AGL produces
- an address for the next page.
- NC
- This would make programming with page-relative modes much less intuitive.
- U

## Sheet 10 of 49
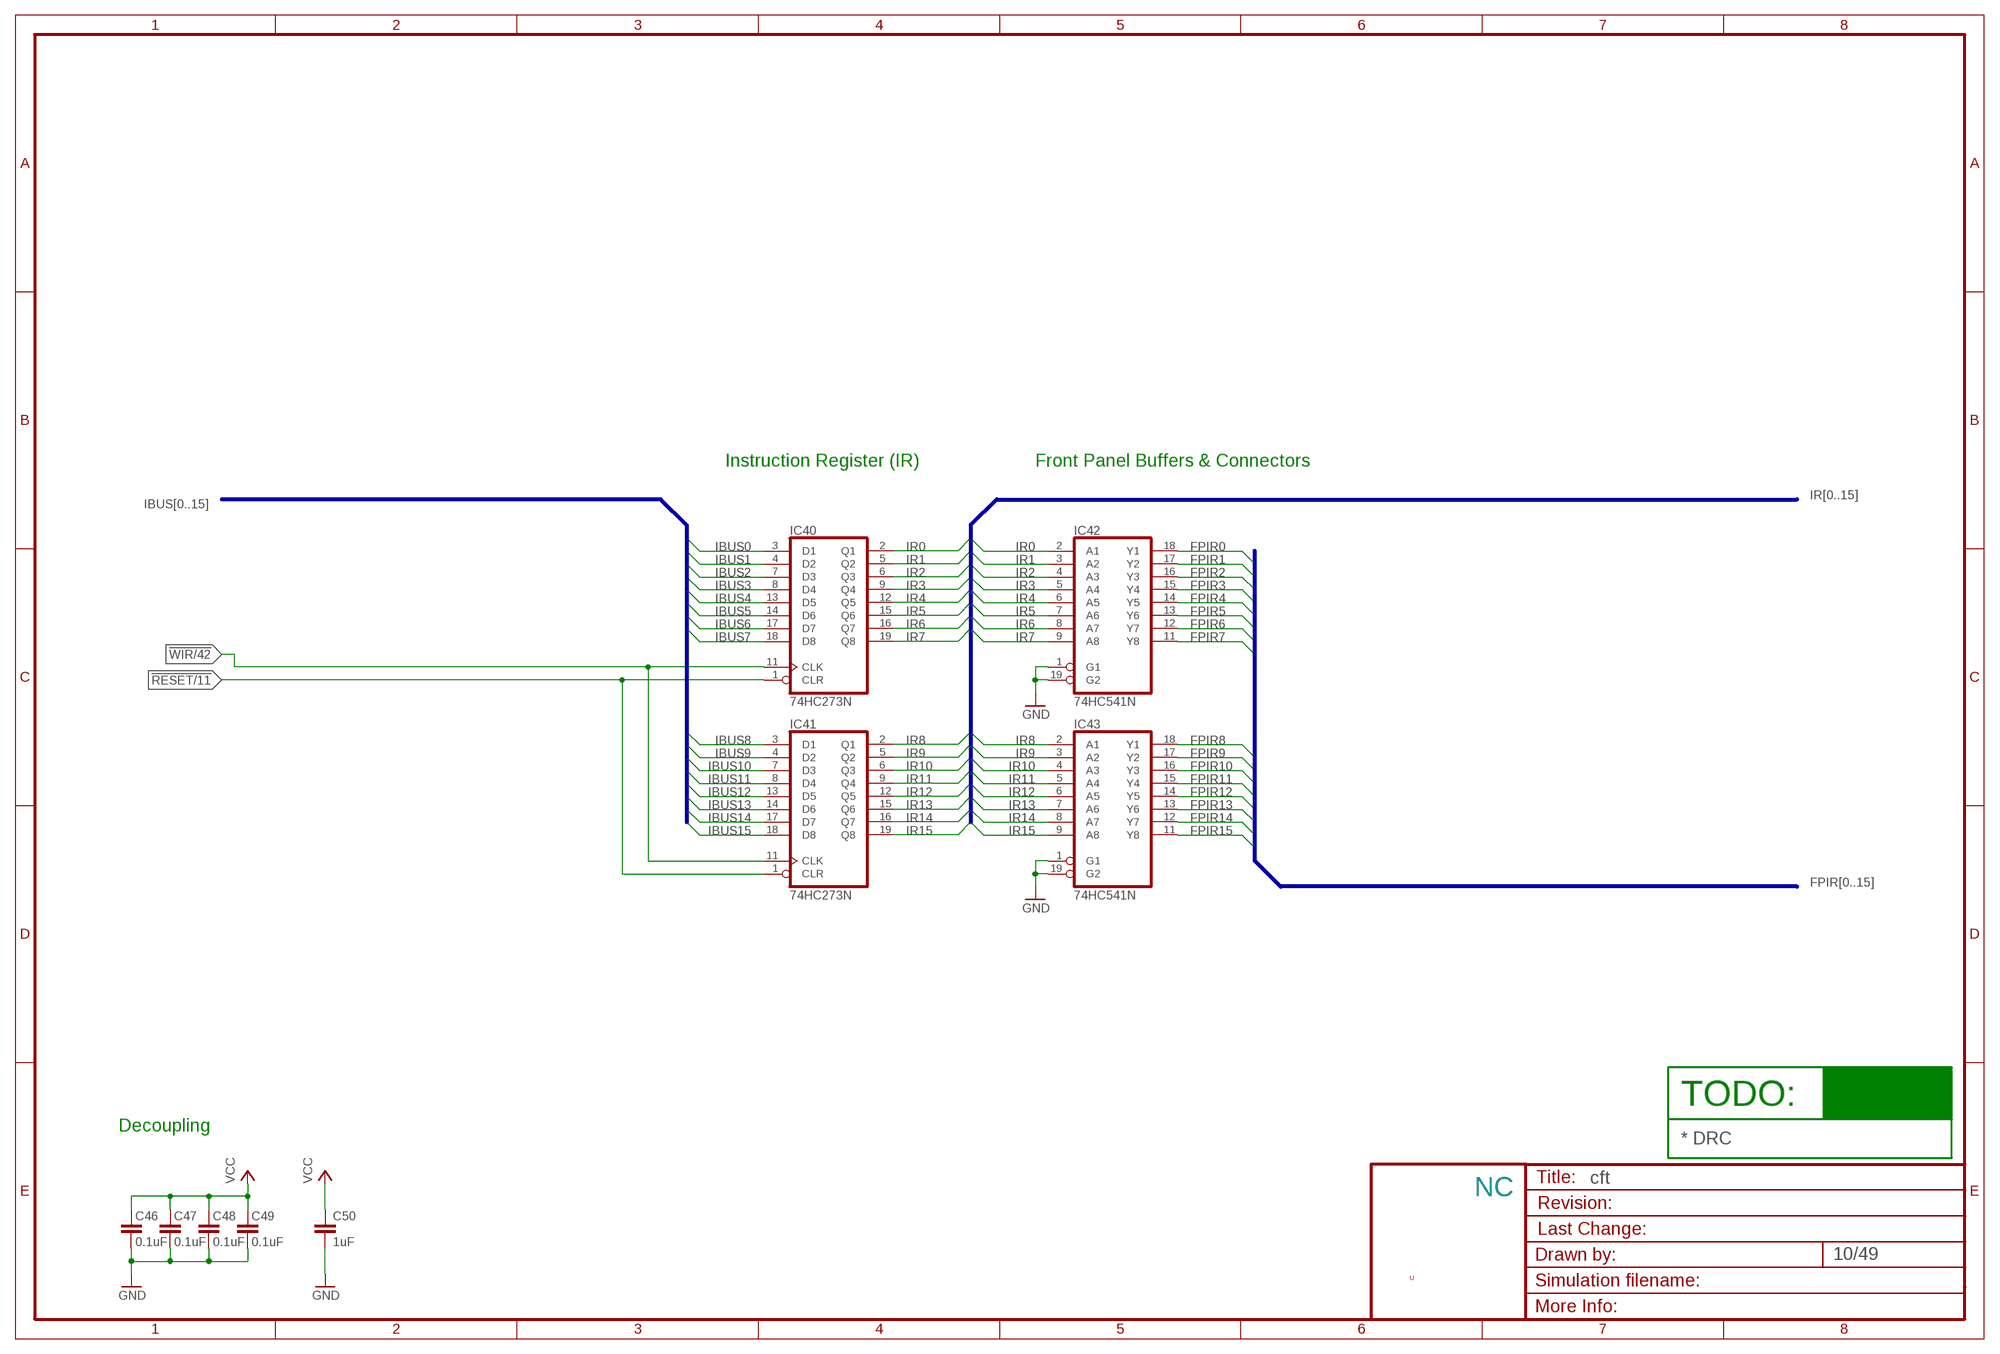
[diagram p9: schematic, sheet 10]

### Parts
C46  0.1uF  C-EU025-024X044  [C025-024X044]
C47  0.1uF  C-EU025-024X044  [C025-024X044]
C48  0.1uF  C-EU025-024X044  [C025-024X044]
C49  0.1uF  C-EU025-024X044  [C025-024X044]
C50  1uF  C-EU025-024X044  [C025-024X044]
IC40  74HC273N  [DIL20]
IC41  74HC273N  [DIL20]
IC42  74HC541N  [DIL20]
IC43  74HC541N  [DIL20]

### Nets
!RESET: IC40.1(CLR) IC41.1(CLR) ; also sheet 2,3,4,7,8,11,12,13,14,17,18,19,20,21,22,25,26,28,29,30,31,44,45,46,47
!WIR: IC40.11(CLK) IC41.11(CLK) ; also sheet 6,7,42
FPIR0: IC42.18(Y1) ; also sheet 6
FPIR1: IC42.17(Y2) ; also sheet 6
FPIR2: IC42.16(Y3) ; also sheet 6
FPIR3: IC42.15(Y4) ; also sheet 6
FPIR4: IC42.14(Y5) ; also sheet 6
FPIR5: IC42.13(Y6) ; also sheet 6
FPIR6: IC42.12(Y7) ; also sheet 6
FPIR7: IC42.11(Y8) ; also sheet 6
FPIR8: IC43.18(Y1) ; also sheet 6
FPIR9: IC43.17(Y2) ; also sheet 6
FPIR10: IC43.16(Y3) ; also sheet 6
FPIR11: IC43.15(Y4) ; also sheet 6
FPIR12: IC43.14(Y5) ; also sheet 6
FPIR13: IC43.13(Y6) ; also sheet 6
FPIR14: IC43.12(Y7) ; also sheet 6
FPIR15: IC43.11(Y8) ; also sheet 6
GND [low power]: C46.1 C47.1 C48.1 C49.1 C50.2 IC42.1(G1) IC42.19(G2) ; also sheet 2,3,4,5,6,7,8,9,11,12,13,14,15,16,17,18,19,20,21,22,24,25,26,27,28,29,30,31,32,33,34,35,36,37,38,39,40,41,42,43,44,45,46,47,48,49
IBUS0: IC40.3(D1) ; also sheet 3,6,9,12,13,14,15,16,18,20
IBUS1: IC40.4(D2) ; also sheet 3,6,9,12,13,14,15,16,18,20
IBUS2: IC40.7(D3) ; also sheet 3,6,9,12,13,14,15,16,18,20
IBUS3: IC40.8(D4) ; also sheet 3,6,9,12,13,14,15,16,18,20
IBUS4: IC40.13(D5) ; also sheet 3,6,9,12,13,14,15,16,18,20
IBUS5: IC40.14(D6) ; also sheet 3,6,9,12,13,14,15,16,18,20
IBUS6: IC40.17(D7) ; also sheet 3,6,9,12,13,14,15,16,18,20
IBUS7: IC40.18(D8) ; also sheet 3,6,9,12,13,14,15,16,18,20
IBUS8: IC41.3(D1) ; also sheet 3,6,9,12,13,14,15,16,18,20
IBUS9: IC41.4(D2) ; also sheet 3,6,9,12,13,14,15,16,18,20
IBUS10: IC41.7(D3) ; also sheet 3,6,9,12,13,14,15,16,18,20
IBUS11: IC41.8(D4) ; also sheet 3,6,9,12,13,14,15,16,18,20
IBUS12: IC41.13(D5) ; also sheet 3,6,9,12,13,14,15,16,18,20
IBUS13: IC41.14(D6) ; also sheet 3,6,9,12,13,14,15,16,18,20
IBUS14: IC41.17(D7) ; also sheet 3,6,9,12,13,14,15,16,18,20
IBUS15: IC41.18(D8) ; also sheet 3,6,9,12,13,14,15,16,18,20
IR0: IC40.2(Q1) IC42.2(A1) ; also sheet 6,8,9,18,32
IR1: IC40.5(Q2) IC42.3(A2) ; also sheet 8,9,32
IR2: IC40.6(Q3) IC42.4(A3) ; also sheet 6,8,9,18,32
IR3: IC40.9(Q4) IC42.5(A4) ; also sheet 8,9,32
IR4: IC40.12(Q5) IC42.6(A5) ; also sheet 8,9,32
IR5: IC40.15(Q6) IC42.7(A6) ; also sheet 8,9,32
IR6: IC40.16(Q7) IC42.8(A7) ; also sheet 8,9,32
IR7: IC40.19(Q8) IC42.9(A8) ; also sheet 8,9,32
IR8: IC41.2(Q1) IC43.2(A1) ; also sheet 8,9,32
IR9: IC41.5(Q2) IC43.3(A2) ; also sheet 8,9,32
IR10: IC41.6(Q3) IC43.4(A3) ; also sheet 9,32
IR11: IC41.9(Q4) IC43.5(A4) ; also sheet 4,6,32,38
IR12: IC41.12(Q5) IC43.6(A5) ; also sheet 4,6,32,38
IR13: IC41.15(Q6) IC43.7(A6) ; also sheet 4,6,32,38
IR14: IC41.16(Q7) IC43.8(A7) ; also sheet 4,6,32,38
IR15: IC41.19(Q8) IC43.9(A8) ; also sheet 4,6,32,38
VCC [low power]: C46.2 C47.2 C48.2 C49.2 C50.1 ; also sheet 2,3,4,6,7,8,9,11,12,13,14,15,16,17,18,19,20,21,22,24,25,26,27,28,29,30,31,34,35,36,37,38,39,40,41,42,43,44,45,46,47,48,49
Unconnected: IC43.1(G1) IC43.19(G2)

### Buses
IBUS[0..15]
IR[0..15]
FPIR[0..15]

### Notes on the sheet
- Instruction Register (IR) | Front Panel Buffers & Connectors
- TODO:
- Decoupling
- * DRC
- NC
- U

## Sheet 11 of 49
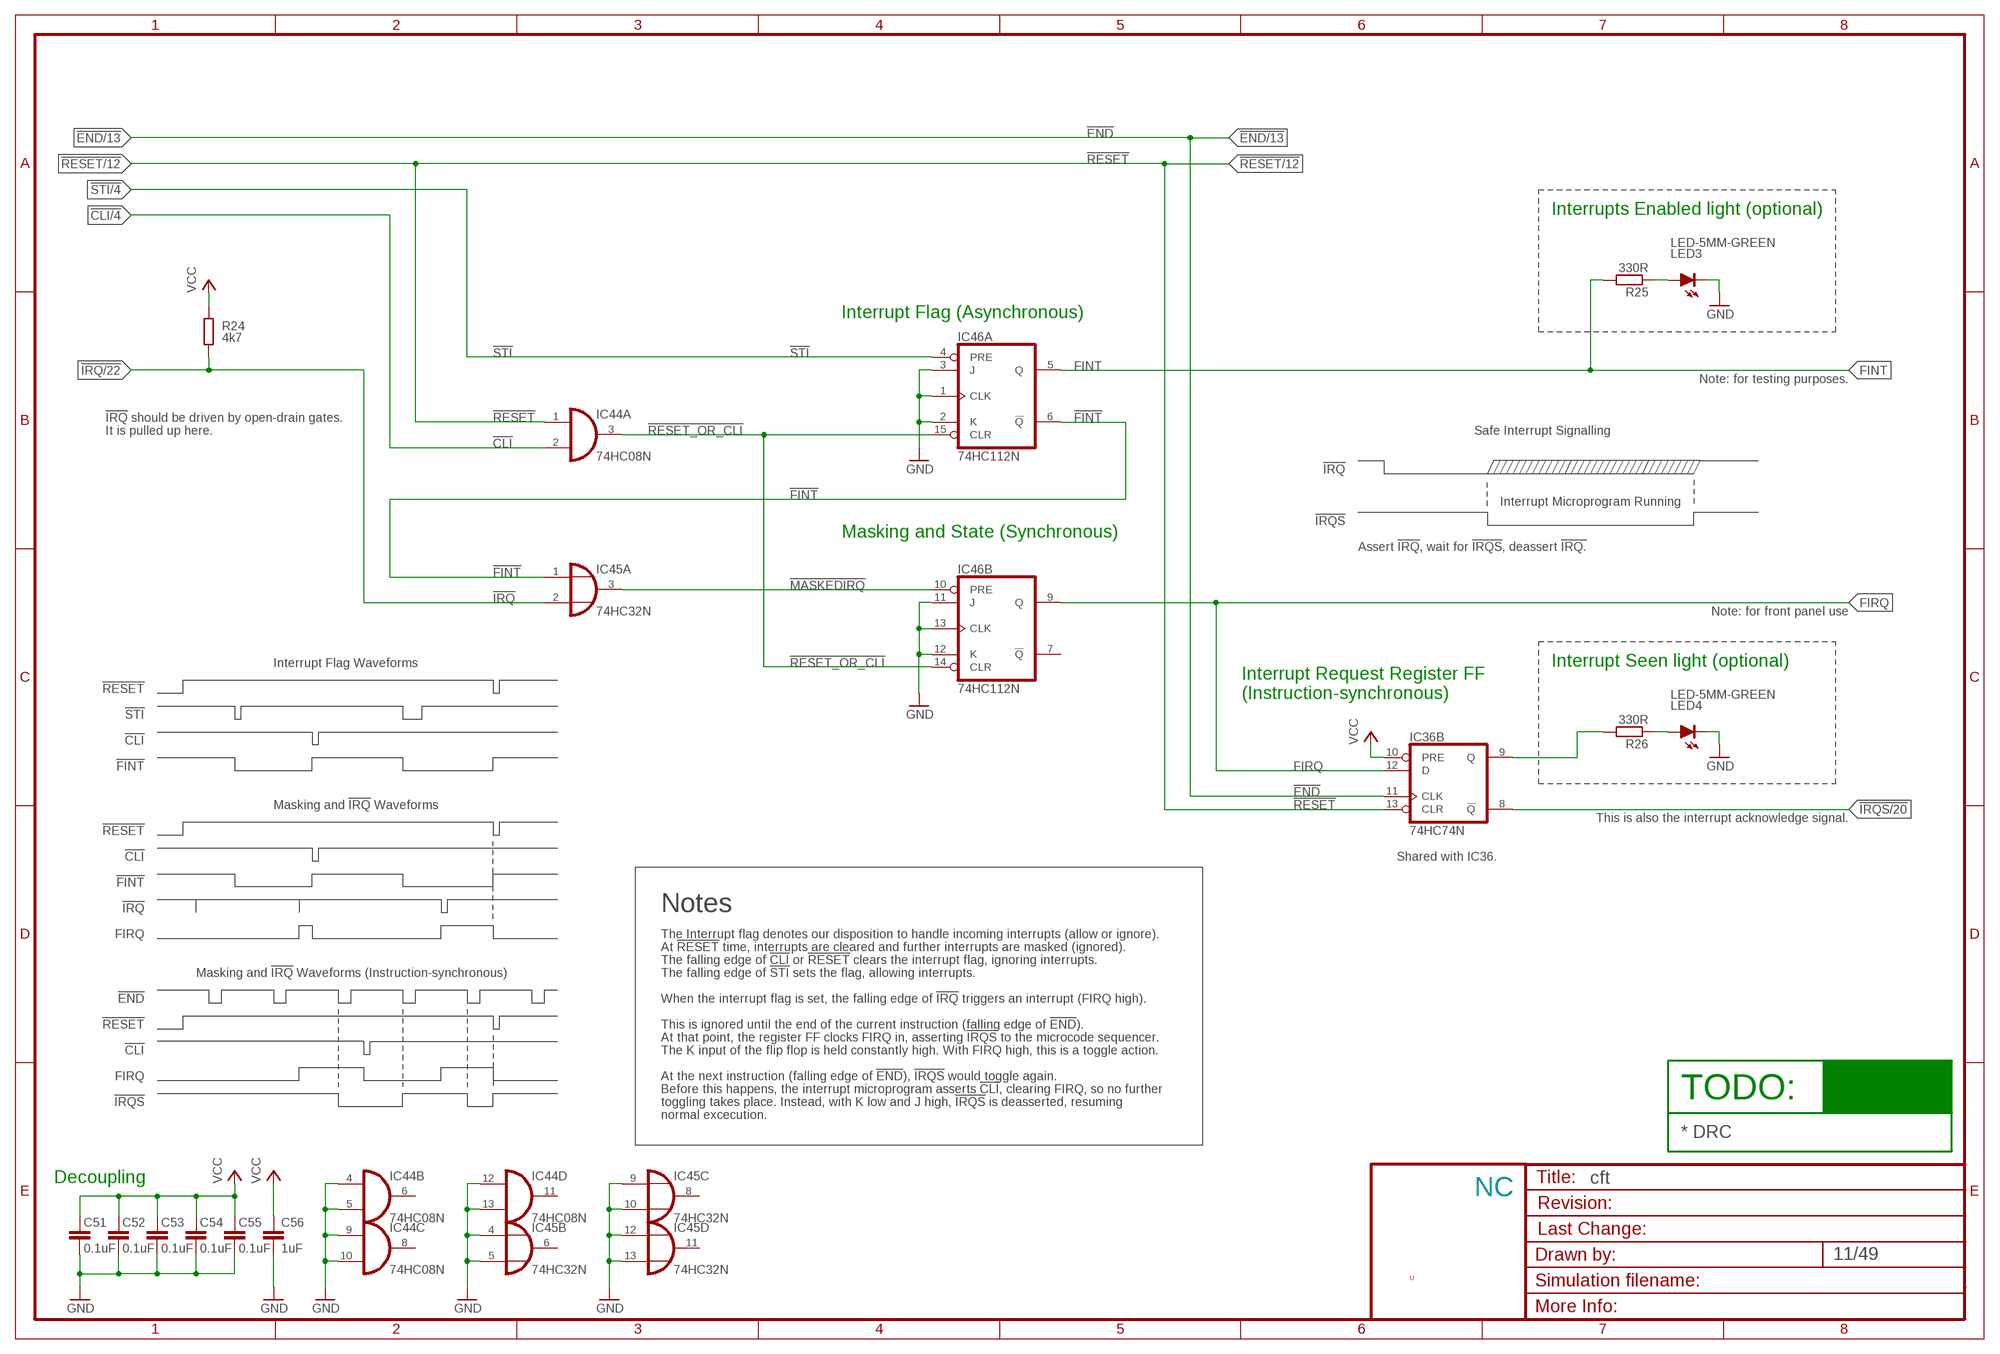
[diagram p10: schematic, sheet 11]

### Parts
C51  0.1uF  C-EU025-024X044  [C025-024X044]
C52  0.1uF  C-EU025-024X044  [C025-024X044]
C53  0.1uF  C-EU025-024X044  [C025-024X044]
C54  0.1uF  C-EU025-024X044  [C025-024X044]
C55  0.1uF  C-EU025-024X044  [C025-024X044]
C56  1uF  C-EU025-024X044  [C025-024X044]
IC44  74HC08N  [DIL14]
IC45  74HC32N  [DIL14]
IC46  74HC112N  [DIL16]
LED3  LED-5MM-GREEN  [LED5MM]
LED4  LED-5MM-GREEN  [LED5MM]
R24  4k7  R-EU_0204/7  [0204/7]
R25  330R  R-EU_0204/7  [0204/7]
R26  330R  R-EU_0204/7  [0204/7]

### Nets
!CLI: IC44.2(A:I1) ; also sheet 4,5,6
!END: IC36.11(B:CLK) ; also sheet 4,5,6,9,13
!FINT: IC45.1(A:I0) IC46.6(A:!Q)
!IRQ: IC45.2(A:I1) R24.1 ; also sheet 22,25,26,27,28,29,30,44,47
!IRQS: IC36.8(B:!Q) ; also sheet 4,6,20,40,44,45,46
!MASKEDIRQ: IC45.3(A:O) IC46.10(B:PRE)
!RESET: IC36.13(B:CLR) IC44.1(A:I0) ; also sheet 2,3,4,7,8,10,12,13,14,17,18,19,20,21,22,25,26,28,29,30,31,44,45,46,47
!RESET_OR_CLI: IC44.3(A:O) IC46.14(B:CLR) IC46.15(A:CLR)
!STI: IC46.4(A:PRE) ; also sheet 4,5,6
FINT: IC46.5(A:Q) R25.2
FIRQ: IC36.12(B:D) IC46.9(B:Q) ; also sheet 6
GND [low power]: C51.1 C52.1 C53.1 C54.1 C55.1 C56.2 IC44.4(B:I0) IC44.5(B:I1) IC44.9(C:I0) IC44.10(C:I1) IC44.12(D:I0) IC44.13(D:I1) IC45.4(B:I0) IC45.5(B:I1) IC45.9(C:I0) IC45.10(C:I1) IC45.12(D:I0) IC45.13(D:I1) IC46.1(A:CLK) IC46.2(A:K) IC46.3(A:J) IC46.11(B:J) IC46.12(B:K) IC46.13(B:CLK) LED3.K(C) LED4.K(C) ; also sheet 2,3,4,5,6,7,8,9,10,12,13,14,15,16,17,18,19,20,21,22,24,25,26,27,28,29,30,31,32,33,34,35,36,37,38,39,40,41,42,43,44,45,46,47,48,49
N$732: LED4.A R26.1
N$733: LED3.A R25.1
N$739: IC36.9(B:Q) R26.2
VCC [low power]: C51.2 C52.2 C53.2 C54.2 C55.2 C56.1 IC36.10(B:PRE) R24.2 ; also sheet 2,3,4,6,7,8,9,10,12,13,14,15,16,17,18,19,20,21,22,24,25,26,27,28,29,30,31,34,35,36,37,38,39,40,41,42,43,44,45,46,47,48,49
Unconnected: IC44.6(B:O) IC44.8(C:O) IC44.11(D:O) IC45.6(B:O) IC45.8(C:O) IC45.11(D:O) IC46.7(B:!Q)

### Notes on the sheet
- Interrupts Enabled light (optional)
- Interrupt Flag (Asynchronous)
- Note: for testing purposes.
- !IRQ! should be driven by open-drain gates.
- It is pulled up here. | Safe Interrupt Signalling
- !IRQ
- Interrupt Microprogram Running
- !IRQS
- Masking and State (Synchronous)
- Assert !IRQ, wait for !IRQS, deassert !IRQ.
- Note: for front panel use
- Interrupt Flag Waveforms | Interrupt Seen light (optional)
- Interrupt Request Register FF
- !RESET
- (Instruction-synchronous)
- !STI
- !CLI
- !FINT
- Masking and !IRQ! Waveforms
- This is also the interrupt acknowledge signal.
- !RESET
- !CLI | Shared with IC36.
- !FINT
- !IRQ | Notes
- FIRQ | The Interrupt flag denotes our disposition to handle incoming interrupts (allow or ignore).
- At !RESET! time, interrupts are cleared and further interrupts are masked (ignored).
- The falling edge of !CLI! or !RESET! clears the interrupt flag, ignoring interrupts.
- Masking and !IRQ! Waveforms (Instruction-synchronous) | The falling edge of !STI! sets the flag, allowing interrupts.
- !END | When the interrupt flag is set, the falling edge of !IRQ! triggers an interrupt (FIRQ high).
- !RESET | This is ignored until the end of the current instruction (falling edge of !END!).
- At that point, the register FF clocks FIRQ in, asserting !IRQS! to the microcode sequencer.
- !CLI | The K input of the flip flop is held constantly high. With FIRQ high, this is a toggle action.
- FIRQ | At the next instruction (falling edge of !END!), !IRQS! would toggle again.
- Before this happens, the interrupt microprogram asserts !CLI!, clearing FIRQ, so no further
- TODO:
- !IRQS | toggling takes place. Instead, with K low and J high, !IRQS! is deasserted, resuming
- normal excecution.
- * DRC
- Decoupling
- NC
- U